# EasyEDA Pro project MicronetToNMEA.eprj

# Schematic MicronetToNMEA

## Sheets
1 MCU: Board Name: Main Board; Create Date: 2025-03-17; Page Name: MCU; Project Name: MicronetToNMEA; Schematic Name: MicronetToNMEA; Update Date: 2025-11-13; Drawn: 17/03/2025; Page Size: A4; Reviewed: No; Version: 3.0
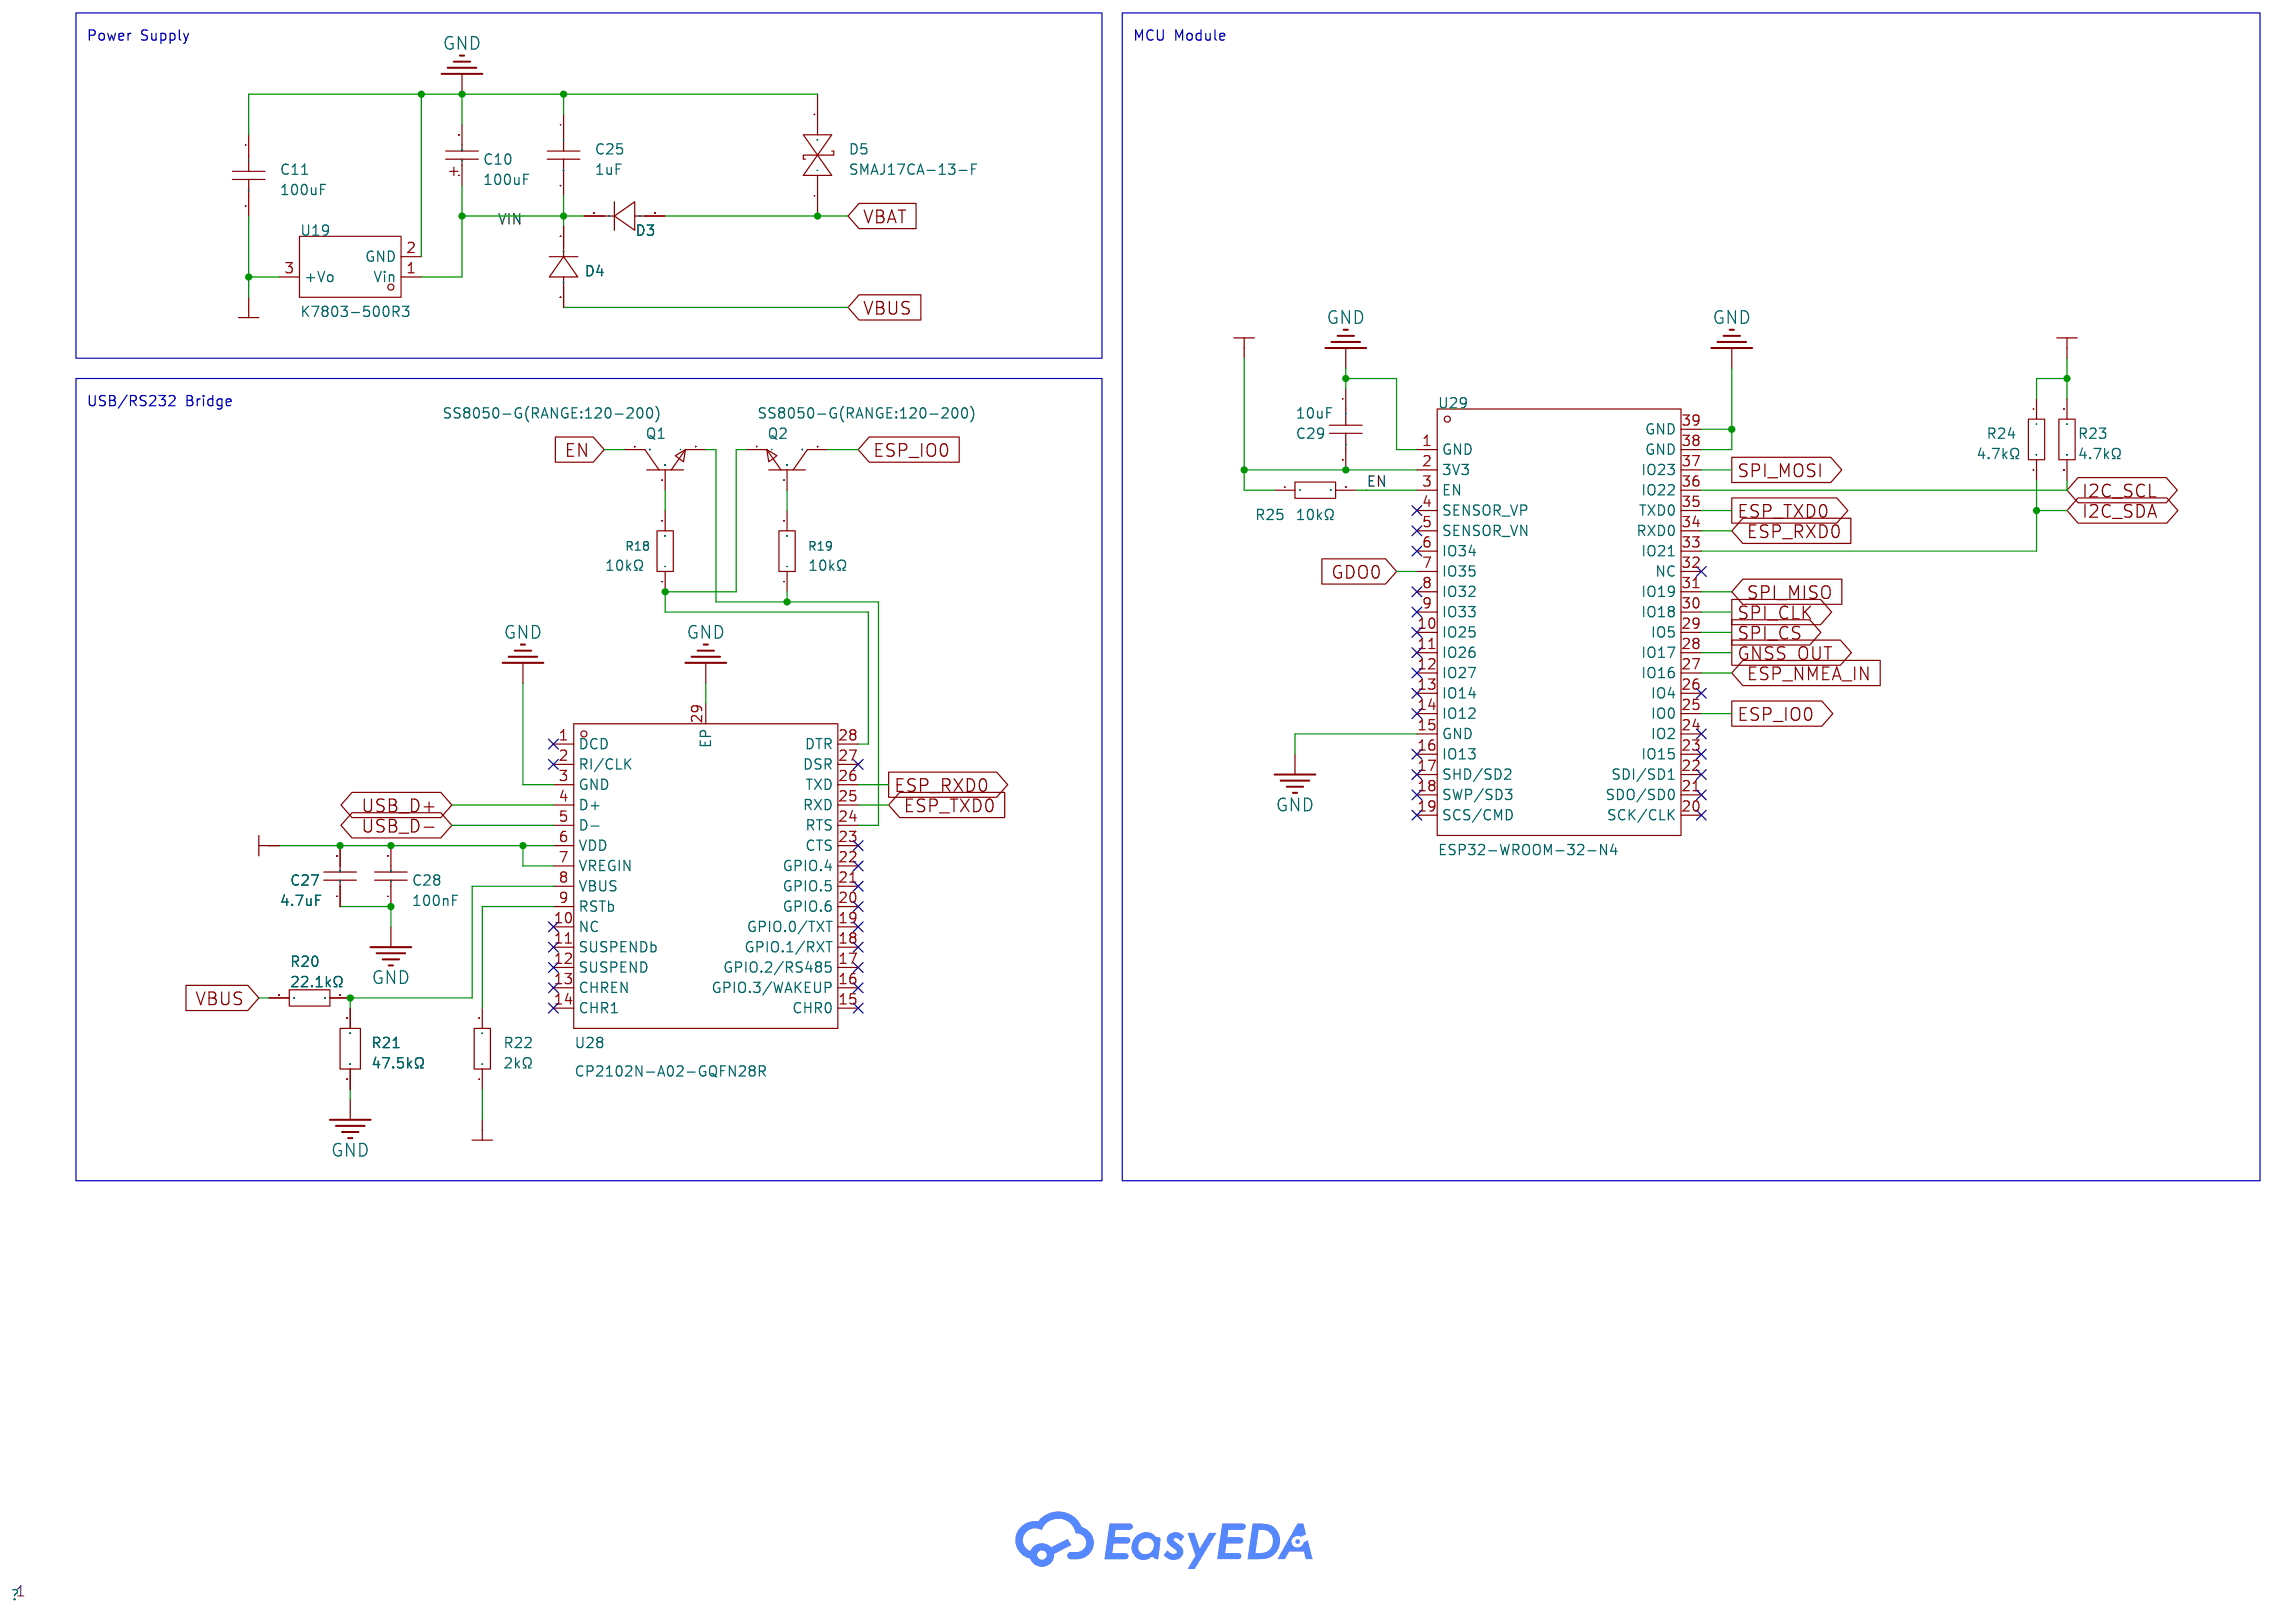
[diagram p0: MCU]
2 Peripherals: Page Name: Peripherals; Update Date: 2025-12-25
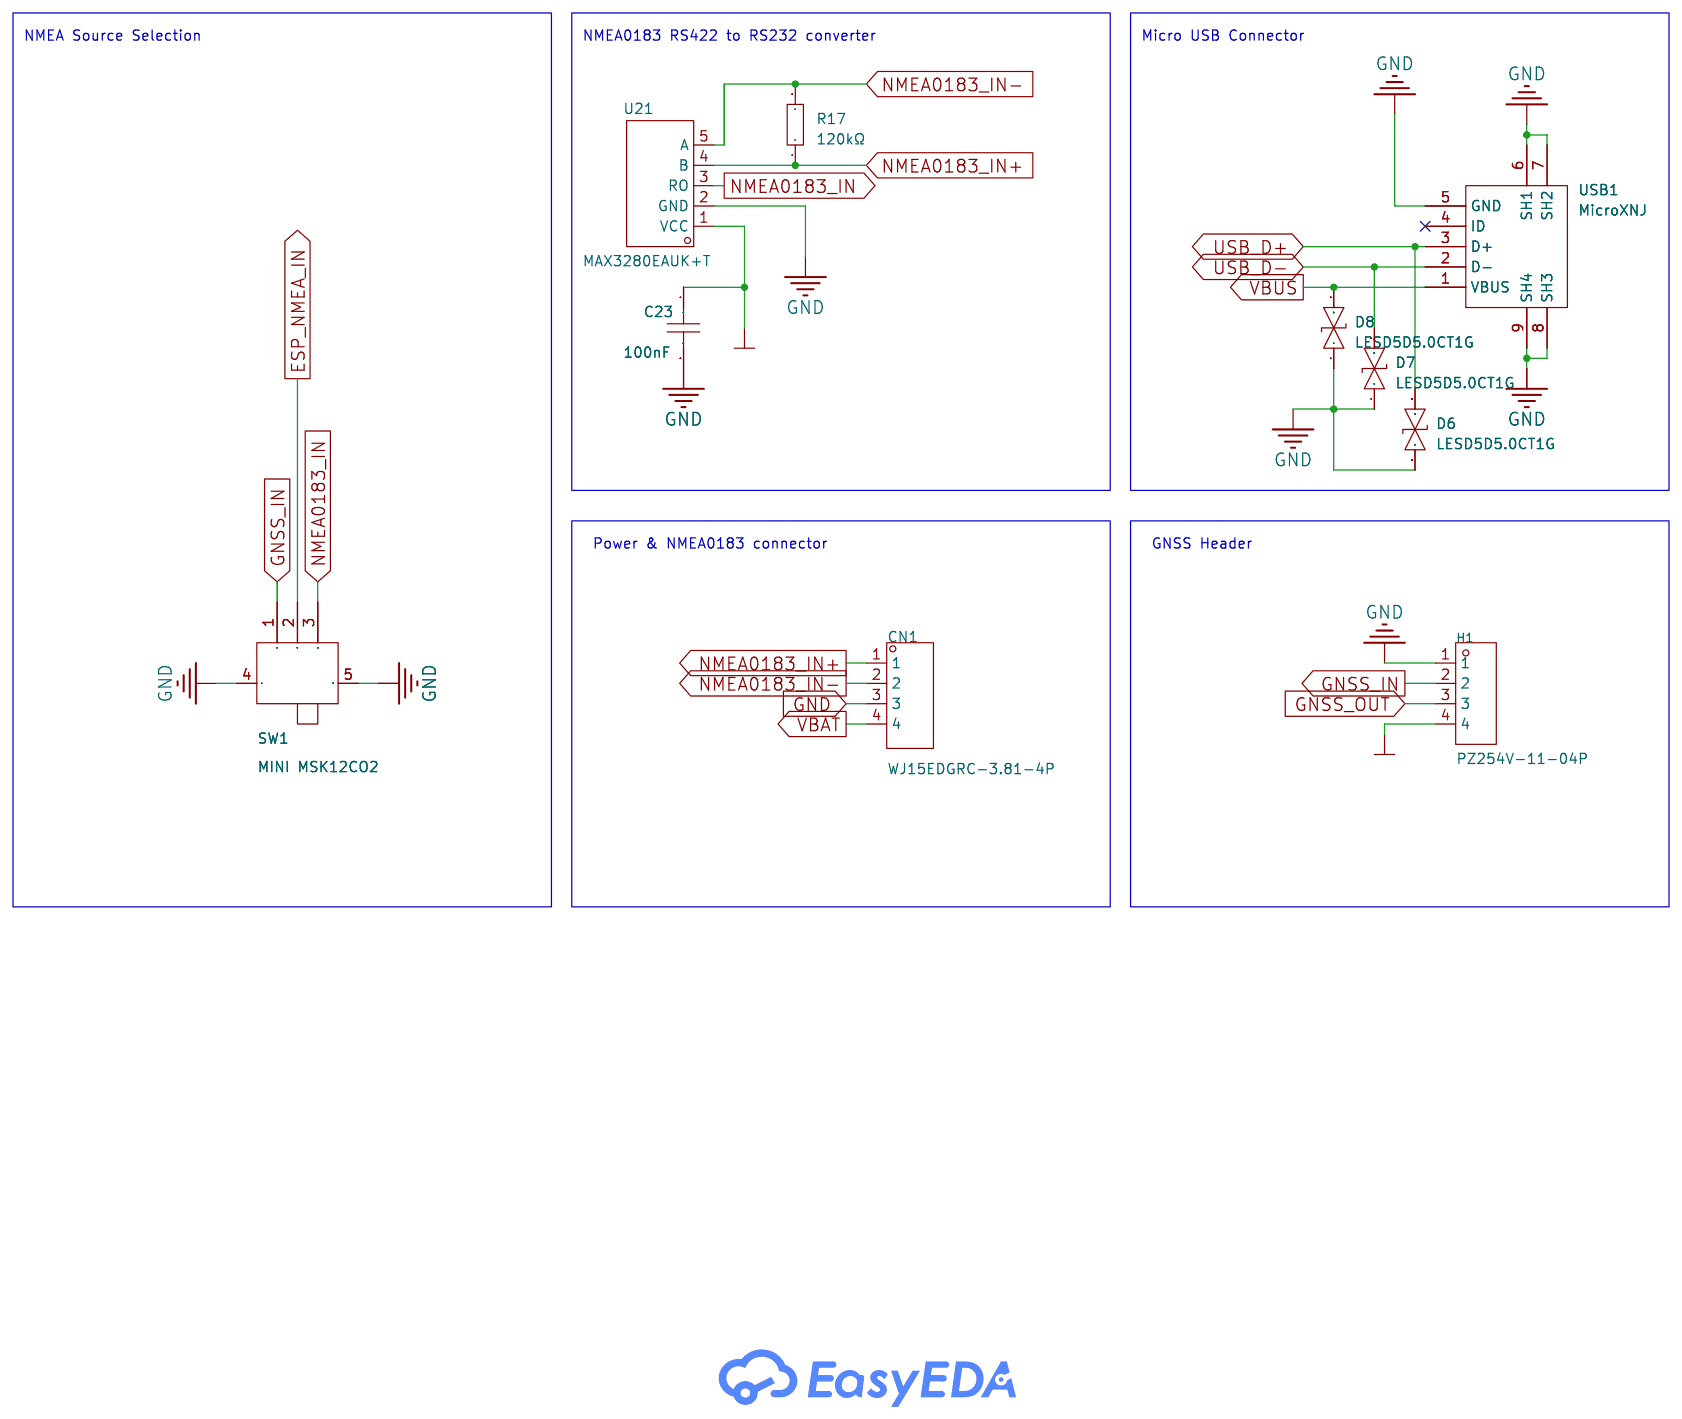
[diagram p1: Peripherals]
3 Micronet RF: Page Name: Micronet RF; Update Date: 2025-03-23
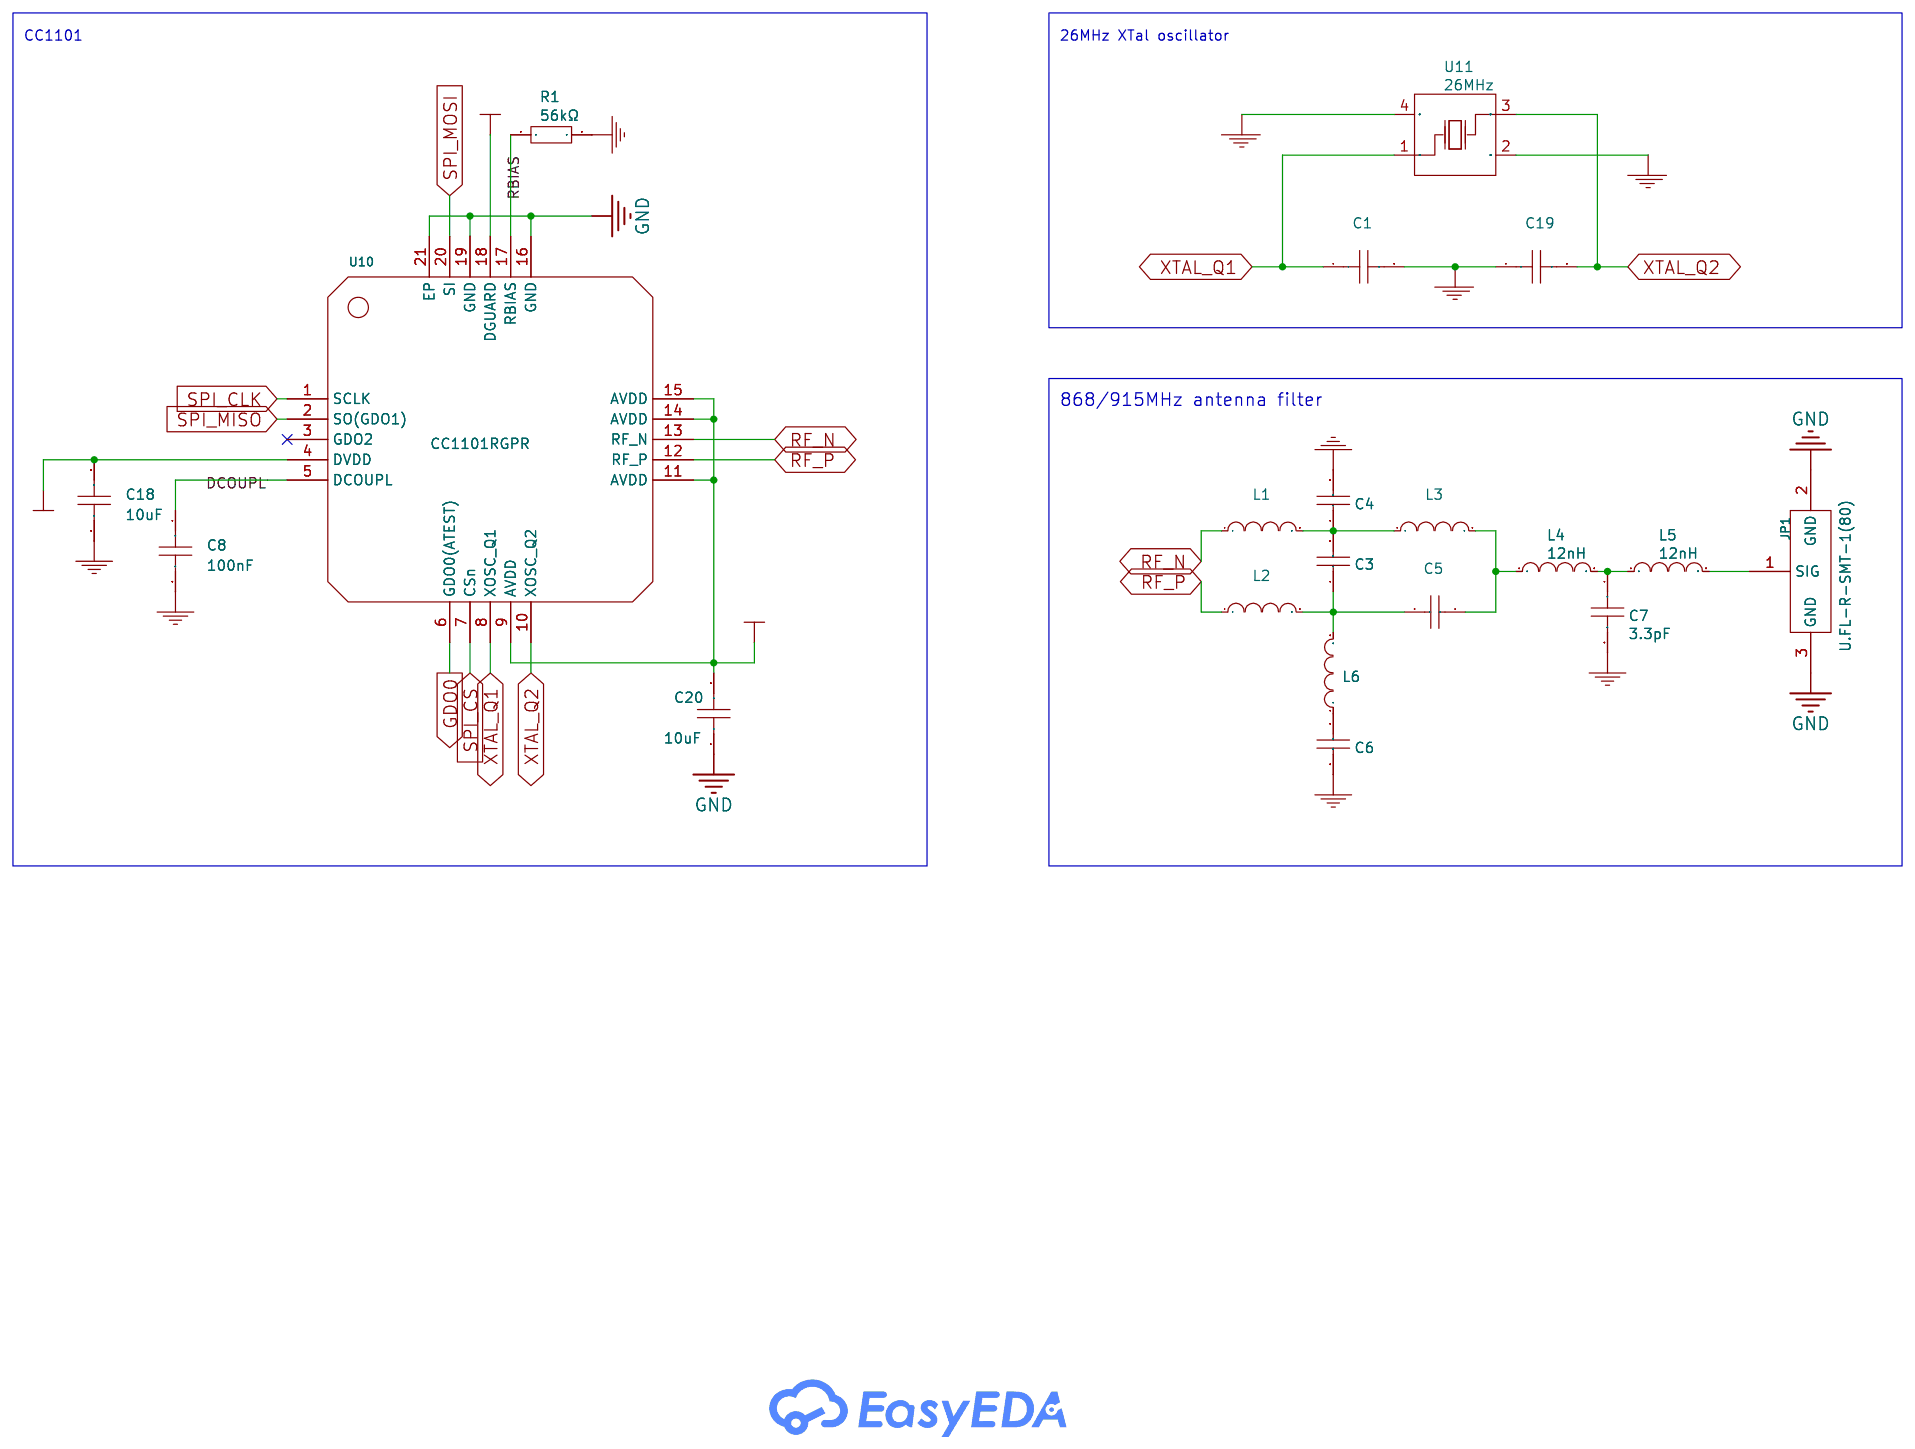
[diagram p2: Micronet RF]
4 Sensors: Page Name: Sensors; Update Date: 2025-03-29
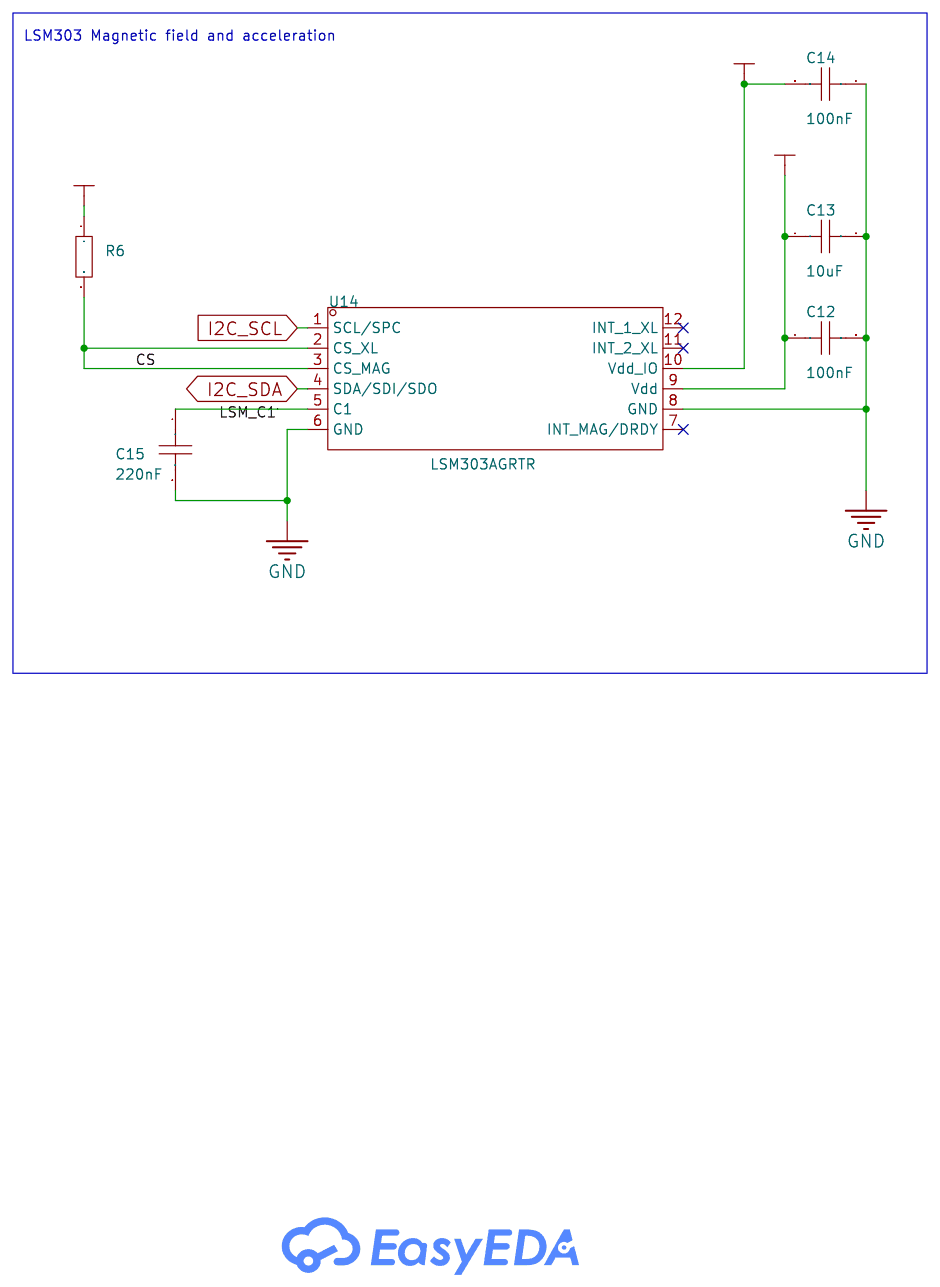
[diagram p3: Sensors]

## Parts
sheet MCU
C10  100uF  [CAP-SMD_BD8.0-L8.3-W8.3-FD]
C11  100uF  [C1210]
C25  1uF  [C0402]
C27  4.7uF  [C0603]
C28  100nF  [C0603]
C29  10uF  [C0603]
D3  1N4007WS  [SOD-323_L1.8-W1.3-LS2.5-RD]
D4  1N4007WS  [SOD-323_L1.8-W1.3-LS2.5-RD]
D5  SMAJ17CA-13-F  [SMA_L4.4-W2.6-LS5.0-BI]
Q1  SS8050-G(RANGE:120-200)  [SOT-23-3_L2.9-W1.3-P1.90-LS2.4-BR]
Q2  SS8050-G(RANGE:120-200)  [SOT-23-3_L2.9-W1.3-P1.90-LS2.4-BR]
R18  10kΩ  [R0603]
R19  10kΩ  [R0603]
R20  22.1kΩ  [R0603]
R21  47.5kΩ  [R0603]
R22  2kΩ  [R0603]
R23  4.7kΩ  [R0402]
R24  4.7kΩ  [R0402]
R25  10kΩ  [R0402]
U19  K7803-500R3  [PWRM-TH_K7803-500R3]
U28  CP2102N-A02-GQFN28R  [QFN-28_L5.0-W5.0-P0.50-TL-EP3.3]
U29  ESP32-WROOM-32-N4  [WIFIM-SMD_ESP32-WROOM-32-N4]
sheet Micronet RF
C1  27pF  [C0402]
C3  1pF  [C0402]
C4  1.5pF  [C0402]
C5  1.5pF  [C0402]
C6  100pF  [C0402]
C7  3.3pF  [C0402]
C8  100nF  [C0402]
C18  10uF  [C0402]
C19  27pF  [C0402]
C20  10uF  [C0402]
JP1  U.FL-R-SMT-1(80)  [RF-SMD_FRF05002-JSS103M]
L1  12nH  [L0402]
L2  12nH  [L0402]
L3  18nH  [L0402]
L4  12nH  [L0402]
L5  12nH  [L0402]
L6  18nH  [L0402]
R1  56kΩ  [R0402]
U10  CC1101RGPR  [QFN-20_L4.0-W4.0-P0.5-TL-EP]
U11  26MHz  [CRYSTAL-SMD_4P-L3.2-W2.5-BL]
sheet Peripherals
C23  100nF  [C0402]
CN1  WJ15EDGRC-3.81-4P  [CONN-TH_WJ15EDGRC-3.81-4P]
D6  LESD5D5.0CT1G  [SOD-523_L1.2-W0.8-LS1.6-BI]
D7  LESD5D5.0CT1G  [SOD-523_L1.2-W0.8-LS1.6-BI]
D8  LESD5D5.0CT1G  [SOD-523_L1.2-W0.8-LS1.6-BI]
H1  PZ254V-11-04P  [HDR-TH_4P-P2.54-V-M]
R17  120kΩ  [R0603]
SW1  MINI MSK12CO2  [SW-SMD_MSK12CO2]
U21  MAX3280EAUK+T  [SOT-23-5_L3.0-W1.7-P0.95-LS2.8-BL]
USB1  MicroXNJ  [MICRO-USB-SMD_MICROXNJ_1]
sheet Sensors
C12  100nF  [C0402]
C13  10uF  [C0402]
C14  100nF  [C0402]
C15  220nF  [C0402]
R6  10kΩ  [R0402]
U14  LSM303AGRTR  [LGA-12_L2.0-W2.0-P0.50-BL]

## Library data of the parts
C10 = EEEFK1H101P_C178548: Capacitance: Tolerance:±20% Tolerance:±20% Rated Voltage: Ripple Current:262.5mA@120Hz Equivalent Series Resistance(ESR):- φD: L: Lifetime @ Temp:5000hrs@105℃ Operating Temperature:-55℃~+105℃ Operating Temperature:-55℃~+105℃; LCSC Part Name: 100uF ±20% 50V; Supplier Part: C178548; Manufacturer: PANASONIC(松下); Manufacturer Part: EEEFK1H101P; Supplier Footprint: SMD,D8xL10.2mm; JLCPCB Part Class: Extended Part; Datasheet: https://atta.szlcsc.com/upload/public/pdf/source/20180327/C178734_B73BC829014A39870A1CD50DCE59BFEE.pdf; Supplier: LCSC; Tolerance: ±20%; Ripple Current: 262.5mA@120Hz; Lifetime @ Temp: 5000hrs@105℃; Operating Temperature: -55℃~+105℃
C11 = EMK325ABJ107MM-P: Capacitance: Tolerance:±20% Tolerance:±20% Voltage Rating: Temperature Coefficient:; LCSC Part Name: MSASE32MAB5107MPNA01 100uF ±20% 16V; Supplier Part: C90143; Manufacturer: TAIYO YUDEN(太诱); Supplier Footprint: 1210; JLCPCB Part Class: Extended Part; Datasheet: https://atta.szlcsc.com/upload/public/pdf/source/20240509/BF3467564CA221DD6EEF2C733FAD3586.pdf; Supplier: LCSC; Tolerance: ±20%
C25 = GRM155R61H105KE05D: Capacitance: Tolerance:±10% Tolerance:±10% Voltage Rated: Temperature Coefficient:; LCSC Part Name: 1uF ±10% 50V; Supplier Part: C1518208; Manufacturer: muRata(村田); Supplier Footprint: 0402; JLCPCB Part Class: Extended Part; Datasheet: https://atta.szlcsc.com/upload/public/pdf/source/20210607/3F03D47137F6EC7729AB4067EB2A6EB3.pdf; Supplier: LCSC; Tolerance: ±10%
C27 = CL10A475KQ8NNNC: LCSC Part Name: 4.7uF ±10% 6.3V; Supplier Part: C8032; Manufacturer: SAMSUNG(三星); Supplier Footprint: 0603; JLCPCB Part Class: Extended Part; Datasheet: https://item.szlcsc.com/datasheet/CL10A475KQ8NNNC/8510.html; Supplier: LCSC; Tolerance: ±10%; Voltage Rating: 6.3V; Temperature Coefficient: X5R
C28 = 0603B104K500NT_C30926: LCSC Part Name: 100nF ±10% 50V; Supplier Part: C30926; Manufacturer: FH(风华); Manufacturer Part: 0603B104K500NT; Supplier Footprint: 0603; JLCPCB Part Class: Extended Part; Datasheet: https://item.szlcsc.com/datasheet/0603B104K500NT/31683.html; Supplier: LCSC; Tolerance: ±10%; Voltage Rating: 50V; Temperature Coefficient: X7R
C29 = CL10A106MO8NQNC: Capacitance: Tolerance:±20% Tolerance:±20% Voltage Rated: Temperature Coefficient:; LCSC Part Name: 10uF ±20% 16V; Supplier Part: C92487; Manufacturer: SAMSUNG(三星); Supplier Footprint: 0603; JLCPCB Part Class: Extended Part; Datasheet: https://atta.szlcsc.com/upload/public/pdf/source/20221212/2AEE4C8656EA91AC055807CAAFF57F96.pdf; Supplier: LCSC; Tolerance: ±20%
D3 D4 = 1N4007WS_C193404: Diode Configuration: Forward Voltage (Vf@If):1.1V@1A Reverse Voltage (Vr): Rectified Current: Reverse Leakage Current:5uA@1kV; LCSC Part Name: 电压:1kV 电流:1A; Supplier Part: C193404; Manufacturer: MDD(辰达半导体); Supplier Footprint: SOD-323; JLCPCB Part Class: Extended Part; Datasheet: https://atta.szlcsc.com/upload/public/pdf/source/20230823/865291948DF6557226235927F2F58F05.pdf; Supplier: LCSC; Forward Voltage (Vf@If): 1.1V@1A; Reverse Leakage Current: 5uA@1kV
D5 = SMAJ17CA-13-F: LCSC Part Name: 双向TVS 17V截止; Supplier Part: C134964; Manufacturer: DIODES(美台); Supplier Footprint: SMA(DO-214AC); JLCPCB Part Class: Extended Part; Datasheet: https://atta.szlcsc.com/upload/public/pdf/source/20180308/C135025_15204897016241413928.pdf; Supplier: LCSC; Reverse Stand-Off Voltage (Vrwm): 17V; Maximum Clamping Voltage: 27.6V; Peak Pulse Current (Ipp): 14.5A; Peak Pulse Power Dissipation (Ppp): 400W; Breakdown Voltage: 18.9V; Type: TVS
Q1 Q2 = SS8050-G(RANGE:120-200): LCSC Part Name: L档(120-200) NPN 电流:1.5A 电压:25V; Supplier Part: C164886; Manufacturer: CJ(江苏长电/长晶); Supplier Footprint: SOT-23; JLCPCB Part Class: Extended Part; Datasheet: https://item.szlcsc.com/datasheet/SS8050-G(RANGE%253A120-200)/176268.html; Supplier: LCSC; type: NPN; Current - Collector(Ic): 1.5A; Collector - Emitter Voltage VCEO: 25V; Pd - Power Dissipation: 300mW; DC Current Gain: 120@100mA,1V; Transition frequency(fT): 100MHz; Current - Collector Cutoff: 100nA; Vce Saturation(VCE(sat)): 500mV@800mA,80mA; Operating Temperature: -55℃~+150℃; Emitter-Base Voltage(Vebo): 5V; Number: 1 NPN
R18 R19 = RMC060310K5%N: LCSC Part Name: 10kΩ ±5% 100mW; Supplier Part: C269684; Manufacturer: Tyohm(幸亚电阻); Supplier Footprint: 0603; JLCPCB Part Class: Extended Part; Datasheet: https://item.szlcsc.com/datasheet/RMC060310K5%2525N/259124.html; Supplier: LCSC; Type: Thick Film Resistor; Tolerance: ±5%; Power(Watts): 100mW; Voltage-Supply(Max): 50V; Temperature Coefficient: ±100ppm/℃; Operating Temperature: -55℃~+155℃
R20 = RC0603FR-0722K1L: LCSC Part Name: 厚膜电阻 22.1kΩ ±1% 100mW; Supplier Part: C137768; Manufacturer: YAGEO(国巨); Supplier Footprint: 0603; JLCPCB Part Class: Extended Part; Datasheet: https://item.szlcsc.com/datasheet/RC0603FR-0722K1L/149084.html; Supplier: LCSC; Type: Thick Film Resistor; Tolerance: ±1%; Power(Watts): 100mW; Voltage-Supply(Max): 75V; Temperature Coefficient: ±100ppm/℃; Operating Temperature: -55℃~+155℃
R21 = RT0603FRE0747K5L: LCSC Part Name: 薄膜电阻 47.5kΩ ±1% 100mW; Supplier Part: C706176; Manufacturer: YAGEO(国巨); Supplier Footprint: 0603; JLCPCB Part Class: Extended Part; Datasheet: https://atta.szlcsc.com/upload/public/pdf/source/20200720/C706176_7967DF4A4839E72D814B188785540CDD.pdf; Supplier: LCSC; Type: Thin Film Resistor; Tolerance: ±1%; Temperature Coefficient: ±50ppm/℃; Operating Temperature Range: -55℃~+155℃
R22 = RTT03202JTP: LCSC Part Name: 厚膜电阻 2kΩ ±5% 100mW; Supplier Part: C103396; Manufacturer: RALEC(旺诠); Supplier Footprint: 0603; JLCPCB Part Class: Extended Part; Datasheet: https://item.szlcsc.com/datasheet/RTT03202JTP/104611.html; Supplier: LCSC; Type: Thick Film Resistor; Tolerance: ±5%; Power(Watts): 100mW; Voltage-Supply(Max): 75V; Temperature Coefficient: ±100ppm/℃; Operating Temperature: -55℃~+155℃
R23 R24 = 0402WGJ0472TCE: Type:Thick Film Resistors Resistance:4.7kΩ Tolerance:±5% Tolerance:±5% Power(Watts): Overload Voltage (Max): Temperature Coefficient:±100ppm/℃ Temperature Coefficient:±100ppm/℃ Operating Temperature Range:-55℃~+155℃ Operating Temperature Range:-55℃~+155℃; LCSC Part Name: 4.7kΩ ±5% 62.5mW 厚膜电阻; Supplier Part: C25940; Manufacturer: UNI-ROYAL(厚声); Supplier Footprint: 0402; JLCPCB Part Class: Extended Part; Datasheet: https://atta.szlcsc.com/upload/public/pdf/source/20200306/C422600_1E6D84923E4A46A82E41ADD87F860B5C.pdf; Supplier: LCSC; Type: Thick Film Resistors; Tolerance: ±5%; Temperature Coefficient: ±100ppm/℃; Operating Temperature Range: -55℃~+155℃
R6 R25 = 0402WGJ0103TCE: Type:Thick Film Resistors Resistance:10kΩ Tolerance:±5% Tolerance:±5% Power(Watts): Overload Voltage (Max): Temperature Coefficient:±100ppm/℃ Temperature Coefficient:±100ppm/℃ Operating Temperature Range:-55℃~+155℃ Operating Temperature Range:-55℃~+155℃; LCSC Part Name: 10kΩ ±5% 62.5mW 厚膜电阻; Supplier Part: C25531; Manufacturer: UNI-ROYAL(厚声); Supplier Footprint: 0402; JLCPCB Part Class: Extended Part; Datasheet: https://atta.szlcsc.com/upload/public/pdf/source/20200306/C422600_1E6D84923E4A46A82E41ADD87F860B5C.pdf; Supplier: LCSC; Type: Thick Film Resistors; Tolerance: ±5%; Temperature Coefficient: ±100ppm/℃; Operating Temperature Range: -55℃~+155℃
U19 = K7803-500R3_C5369643: Supplier Part: C5369643; Manufacturer: YLPTEC(易川); Supplier Footprint: SIP,11.5x7.6mm; JLCPCB Part Class: Extended Part; Datasheet: https://atta.szlcsc.com/upload/public/pdf/source/20231130/A27A2C6619C01D10262DE302026A4639.pdf; Supplier: LCSC; Conversion Type: DC-DC; Function: Step-down type; Input Voltage(DC): 4.75V~36V; Output Voltage: 3.3V; Output Power: 1.65W; Output Current (Max): 500mA; Output Channel: 1; Conversion Efficiency: 96%; Feature: Short-Circuit  Protection; Maximum Capacitive Load: 680uF
U28 = CP2102N-A02-GQFN28R: Supplier Part: C964632; Manufacturer: SKYWORKS/SILICON LABS(芯科); Supplier Footprint: QFN-28-EP(5x5); JLCPCB Part Class: Extended Part; Datasheet: https://item.szlcsc.com/datasheet/CP2102N-A02-GQFN28R/1049893.html; Supplier: LCSC; Applications Function: USB to UART; USB Protocol: USB 2.0; Voltage - Supply: 3V~3.6V; Operating Temperature: -40℃~+85℃@(Ta); Current - Supply: 9.5mA; Supply Current (Iq): 1.3uA
U29 = ESP32-WROOM-32-N4: LCSC Part Name: WiFi+蓝牙4.2+双核CPU模块; Supplier Part: C82899; Manufacturer: ESPRESSIF(乐鑫); Supplier Footprint: SMD,18x25.5mm; JLCPCB Part Class: Extended Part; Datasheet: https://atta.szlcsc.com/upload/public/pdf/source/20241030/CCB539BBE3BF966BF47741EF6F78A315.pdf; Supplier: LCSC
C1 C19 = GJM1555C1H270FB01D: Capacitance: Tolerance:±1% Tolerance:±1% Voltage Rated: Temperature Coefficient:; LCSC Part Name: 27pF ±1% 50V; Supplier Part: C88883; Manufacturer: muRata(村田); Supplier Footprint: 0402; JLCPCB Part Class: Extended Part; Datasheet: https://atta.szlcsc.com/upload/public/pdf/source/20190904/C426118_85E81C7C1F21FC87C5FB6D536E0847B4.pdf; Supplier: LCSC; Tolerance: ±1%; Check: true
C3 = GRM1555C1H1R0CA01D: Capacitance: Voltage Rated: Temperature Coefficient:; LCSC Part Name: 1pF 50V; Supplier Part: C76953; Manufacturer: muRata(村田); Supplier Footprint: 0402; JLCPCB Part Class: Extended Part; Datasheet: https://atta.szlcsc.com/upload/public/pdf/source/20180307/C76953_15204091218821407741.pdf; Supplier: LCSC; Check: true
C4 C5 = GRM1555C1H1R5BA01D: Capacitance: Voltage Rated: Temperature Coefficient:; LCSC Part Name: 1.5pF 50V; Supplier Part: C76957; Manufacturer: muRata(村田); Supplier Footprint: 0402; JLCPCB Part Class: Extended Part; Datasheet: https://atta.szlcsc.com/upload/public/pdf/source/20180307/C76957_15204091256371407745.pdf; Supplier: LCSC; Check: true
C6 = GRM1555C1H101JA01D: Capacitance: Tolerance:±5% Tolerance:±5% Voltage Rated: Temperature Coefficient:; LCSC Part Name: 100pF ±5% 50V; Supplier Part: C77177; Manufacturer: muRata(村田); Supplier Footprint: 0402; JLCPCB Part Class: Extended Part; Datasheet: https://atta.szlcsc.com/upload/public/pdf/source/20161108/1478586482814.pdf; Supplier: LCSC; Tolerance: ±5%; Check: true
C7 = GRM1555C1H3R3CA01D: Capacitance: Voltage Rated: Temperature Coefficient:; LCSC Part Name: 3.3pF 50V; Supplier Part: C76968; Manufacturer: muRata(村田); Supplier Footprint: 0402; JLCPCB Part Class: Extended Part; Datasheet: https://atta.szlcsc.com/upload/public/pdf/source/20180326/C76968_42A943F46D0EB2822F2395CFA6966D50.pdf; Supplier: LCSC; Check: true
C8 = GRM155R62A104KE14D: Capacitance: Tolerance:±10% Tolerance:±10% Voltage Rated: Temperature Coefficient:; LCSC Part Name: 100nF ±10% 100V; Supplier Part: C162178; Manufacturer: muRata(村田); Supplier Footprint: 0402; JLCPCB Part Class: Extended Part; Datasheet: https://atta.szlcsc.com/upload/public/pdf/source/20200921/C162178_EF61A2DC43497DE67E2F462D3389BE9B.pdf; Supplier: LCSC; Tolerance: ±10%; Check: true
C18 C20 = GRM155R61A106ME44D: Capacitance: Tolerance:±20% Tolerance:±20% Voltage Rated: Temperature Coefficient:; LCSC Part Name: 10uF ±20% 10V; Supplier Part: C77000; Manufacturer: muRata(村田); Supplier Footprint: 0402; JLCPCB Part Class: Extended Part; Datasheet: https://atta.szlcsc.com/upload/public/pdf/source/20180530/C77000_4866797CFE3A842CD03C597EBD6AE6CD.pdf; Supplier: LCSC; Tolerance: ±20%
JP1 = U.FL-R-SMT-1(80)_C88374: Connector Type:板端 Interface Type:内针 Number of Ports:1 Interface Diameter:2mm Interface Length/Height:1.25mm Frequency-Max:6GHz RF Series:IPEX Impedance:50Ω Style:- Contact Material:Brass Operating Temperature Range:-40℃~+90℃ Operating Temperature Range:-4; LCSC Part Name: IPEX 内针; Supplier Part: C88374; Manufacturer: HRS(广濑); Supplier Footprint: SMD; JLCPCB Part Class: Extended Part; Datasheet: https://atta.szlcsc.com/upload/public/pdf/source/20161125/1480067868647.pdf; Supplier: LCSC; Connector Type: 板端; Interface Type: 内针; Number of Ports: 1; Interface Diameter: 2mm; Interface Length/Height: 1.25mm; Frequency-Max: 6GHz; RF Series: IPEX; Impedance: 50Ω; Contact Material: Brass; Operating Temperature Range: -40℃~+90℃; Check: true
L1 L2 = LQW15AN12NJ00D: Inductance: Tolerance:±5% Tolerance:±5% Rated Current: Saturation Current (Isat):- DC Resistance (DCR): Ratings:-; LCSC Part Name: 12nH ±5%; Supplier Part: C82920; Manufacturer: muRata(村田); Supplier Footprint: 0402; JLCPCB Part Class: Extended Part; Datasheet: https://atta.szlcsc.com/upload/public/pdf/source/20170505/1493951387766.pdf; Supplier: LCSC; Tolerance: ±5%; Check: true
L3 L6 = LQW15AN18NJ00D: Inductance: Tolerance:±5% Tolerance:±5% Rated Current: Saturation Current (Isat):- DC Resistance (DCR): Ratings:-; LCSC Part Name: 18nH ±5%; Supplier Part: C82917; Manufacturer: muRata(村田); Supplier Footprint: 0402; JLCPCB Part Class: Extended Part; Datasheet: https://atta.szlcsc.com/upload/public/pdf/source/20170325/1490427880337.pdf; Supplier: LCSC; Tolerance: ±5%; Check: true
L4 L5 = LQW15AN12NG00D: Inductance: Tolerance:±2% Tolerance:±2% Rated Current: Saturation Current (Isat):- DC Resistance (DCR): Ratings:-; LCSC Part Name: 12nH ±2%; Supplier Part: C86128; Manufacturer: muRata(村田); Supplier Footprint: 0402; JLCPCB Part Class: Extended Part; Datasheet: https://atta.szlcsc.com/upload/public/pdf/source/20161104/1478253457680.pdf; Supplier: LCSC; Tolerance: ±2%; Check: true
R1 = RK73H1ETTP5602F: Type:Thick Film Resistors Resistance: Tolerance:±1% Tolerance:±1% Power(Watts): Overload Voltage (Max): Temperature Coefficient:±100ppm/℃ Temperature Coefficient:±100ppm/℃ Operating Temperature Range:-55℃~+155℃ Operating Temperature Range:-55℃~+155℃; LCSC Part Name: 厚膜电阻 56kΩ ±1% 100mW; Supplier Part: C71703; Manufacturer: KOA; Supplier Footprint: 0402; JLCPCB Part Class: Extended Part; Datasheet: https://atta.szlcsc.com/upload/public/pdf/source/20180126/C171778_15169517982501308609.pdf; Supplier: LCSC; Type: Thick Film Resistors; Tolerance: ±1%; Temperature Coefficient: ±100ppm/℃; Operating Temperature Range: -55℃~+155℃; Check: true
U10 = CC1101RGPR: Frequency Range:779MHz~928MHz；300MHz~348MHz Frequency Range:779MHz~928MHz；300MHz~348MHz Interface:SPI Operating Voltage:1.8V~3.6V Operating Voltage:1.8V~3.6V Applications:General-purposeISM Output Power:12dBm Data Rate:600Kbps Current Of Transmitting:12.3; LCSC Part Name: 低功率射频收发器 专为极低功耗无线应用设计; Supplier Part: C29953; Manufacturer: TI(德州仪器); Supplier Footprint: QFN-20-EP(4x4); JLCPCB Part Class: Extended Part; Datasheet: https://www.ti.com/cn/lit/gpn/cc1101; Supplier: LCSC; Frequency Range: 779MHz~928MHz；300MHz~348MHz; Interface: SPI; Operating Voltage: 1.8V~3.6V; Applications: General-purposeISM; Output Power: 12dBm; Data Rate: 600Kbps; Current Of Transmitting: 12.3mA; Sensitivity: -116dBm; Receive Current: 14.3mA; Typical Application Frequency: 433MHz；315MHz; Operating Temperature: -40℃~+85℃; Check: true
U11 = S3226000151040: Crystal Type:贴片晶振 Frequency: Normal temperature Frequency Tolerance:±10ppm Normal temperature Frequency Tolerance:±10ppm External load capacitor: Equivalent Series Resistance (ESR):40Ω Operating Temperature: Operating Temperature:; LCSC Part Name: 26MHz ±10ppm 15pF; Supplier Part: C479205; Manufacturer: JGHC(晶光华); Supplier Footprint: SMD3225-4P; JLCPCB Part Class: Extended Part; Datasheet: https://atta.szlcsc.com/upload/public/pdf/source/20230522/40D5BBD3CE23FDD9A2980F79514F1325.pdf; Supplier: LCSC; Crystal Type: 贴片晶振; Normal temperature Frequency Tolerance: ±10ppm; Equivalent Series Resistance (ESR): 40Ω; Check: true
C12 C14 C23 = CL05B104KO5NNNC: Capacitance: Tolerance:±10% Tolerance:±10% Voltage Rated: Temperature Coefficient:; LCSC Part Name: 100nF ±10% 16V; Supplier Part: C1525; Manufacturer: SAMSUNG(三星); Supplier Footprint: 0402; JLCPCB Part Class: Basic Part; Datasheet: https://atta.szlcsc.com/upload/public/pdf/source/20160218/1457707763339.pdf; Supplier: LCSC; Tolerance: ±10%
CN1 = WJ15EDGRC-3.81-4P: Connector Type:Receptacle-Close fixed form:- Structure:1x4P Pitch:3.81mm Color:- Mounting Style:Bend Number of Pins:4P Number of Rows:1 Number of PINs Per Row:4 Current Rating (Max):8A Voltage Rating (Max):300V Wire Gauge - AWG:- Wire Gauge - AWG:- Wire G; LCSC Part Name: 1x4P 3.81mm 排数:1 每排P数:4; Supplier Part: C7245; Manufacturer: KANGNEX(康奈克斯电气); Supplier Footprint: 弯插,P=3.81mm; JLCPCB Part Class: Extended Part; Datasheet: https://atta.szlcsc.com/upload/public/pdf/source/20191225/C7245_837ECEBE031BAC19A7EBD4F3127022E5.pdf; Supplier: LCSC; Connector Type: Receptacle-Close; Structure: 1x4P; Pitch: 3.81mm; Mounting Style: Bend; Number of Pins: 4P; Number of Rows: 1; Number of PINs Per Row: 4; Current Rating (Max): 8A; Voltage Rating (Max): 300V; Contact Material: Brass; Contact Plating: Tin; Operating Temperature Range: -40℃~+105℃
D6-D8 = LESD5D5.0CT1G_C41399463: LCSC Part Name: 双向ESD 5V截止 峰值脉冲电流：7A; Supplier Part: C41399463; Manufacturer: GOODWORK(固得沃克); Supplier Footprint: SOD-523; JLCPCB Part Class: Extended Part; Datasheet: https://item.szlcsc.com/datasheet/LESD5D5.0CT1G/43196790.html; Supplier: LCSC; Polarity: Bidirectional; Reverse Stand-Off Voltage (Vrwm): 5V; Clamping Voltage: 16V; Peak Pulse Current (Ipp): 7A; Peak Pulse Power Dissipation (Ppp): 100W; Voltage - Breakdown: 7V; Reverse Leakage Current (Ir): 1uA; Operating Temperature: -55℃~+150℃@(Tj); level of protection: IEC 61000-4-2; Type: ESD; Junction Capacitance: 12pF
H1 = PZ254V-11-04P: LCSC Part Name: 1x4P 间距:2.54mm 方针 直插; Supplier Part: C2691448; Manufacturer: XFCN(兴飞); Supplier Footprint: 插件,P=2.54mm; JLCPCB Part Class: Extended Part; Datasheet: https://item.szlcsc.com/datasheet/PZ254V-11-04P/2801085.html; Supplier: LCSC; Pin Structure: 1x4P; Pitch: 2.54mm; Circluar Pins/Square Pins: Pin Header; Mounting Type: Through Hole; Number of Rows: 1; Number of Pins: 4P; Current Rating: 3A; Voltage Rating (Max): 250V; Length of Mating Pin: 6mm; Insulation Height: 2.5mm; Length of End Connection Pin: 3mm; Operating Temperature: -40℃~+105℃; Color: Black
R17 = 0603WAF1203T5E: Type:Thick Film Resistor Resistance:120kΩ Tolerance:±1% Tolerance:±1% Power(Watts):100mW Voltage-Supply(Max):75V Temperature Coefficient:±100ppm/℃ Temperature Coefficient:±100ppm/℃ Operating Temperature:-55℃~+155℃ Operating Temperature:-55℃~+155℃; LCSC Part Name: 120kΩ ±1% 100mW 厚膜电阻; Supplier Part: C25808; Manufacturer: UNI-ROYAL(厚声); Supplier Footprint: 0603; JLCPCB Part Class: Basic Part; Datasheet: https://item.szlcsc.com/datasheet/0603WAF1203T5E/26551.html; Supplier: LCSC; Type: Thick Film Resistor; Tolerance: ±1%; Power(Watts): 100mW; Voltage-Supply(Max): 75V; Temperature Coefficient: ±100ppm/℃; Operating Temperature: -55℃~+155℃
SW1 = MINI MSK12CO2: LCSC Part Name: 迷你七脚两档侧拨拨动 mini七7脚 微型拨动; Supplier Part: C2681570; Manufacturer: SHOU HAN(首韩); Supplier Footprint: SMD,5x2.8mm; JLCPCB Part Class: Extended Part; Datasheet: https://item.szlcsc.com/datasheet/MINI%2520MSK12CO2/2774913.html; Supplier: LCSC; Circuit: SPDT; Actuator Style: Rectangular Columnar; Termination Style: SMD(SMT) Tab; Length: 5mm; Width: 2.75mm; Switch Height: 1.4mm; Mounting Type: Surface Mount, Right Angle; Actuator Color: White; Current Rating: 50mA; Voltage Rating: 12V; Life: 10,000 Cycles; Operating Temperature: -25℃~+70℃
U21 = MAX3280EAUK+T: Types:Receivers Number of Driver:0 Number of receiver:1 Supply Voltage:3V~5.5V Supply Voltage:3V~5.5V Data Rate:52Mbps Data Rate:52Mbps Operating Temperature:-40℃~+125℃ Operating Temperature:-40℃~+125℃; LCSC Part Name: ±15kV ESD保护，52Mbps，3V至5.5V，SOT23封装RS-485/RS-422真故障安全接收器; Supplier Part: C131126; Manufacturer: ADI(亚德诺)/MAXIM(美信); Supplier Footprint: SOT-23-5; JLCPCB Part Class: Extended Part; Datasheet: https://atta.szlcsc.com/upload/public/pdf/source/20170919/C131126_1505787254709976995.pdf; Supplier: LCSC; Types: Receivers; Number of Driver: 0; Number of receiver: 1; Supply Voltage: 3V~5.5V; Data Rate: 52Mbps; Operating Temperature: -40℃~+125℃; Check: true
USB1 = MicroXNJ: LCSC Part Name: Micro-B 母 卧贴; Supplier Part: C404969; Manufacturer: SHOU HAN(首韩); Supplier Footprint: SMD; JLCPCB Part Class: Extended Part; Datasheet: https://item.szlcsc.com/datasheet/MicroXNJ/392534.html; Supplier: LCSC; Connector Type: Micro-B; Protocol Standard: USB 2.0; Gender: Female; Mounting Type: Surface Mount, Right Angle; Number of Contacts: 5P; Number of Ports: 1; Current Rating-Power: 1.8A; Voltage Rating: 30V; Connect-Disconnect Life: 5,000 times; Detection color: Black; Operating Temperature: -20℃~+85℃
C13 = GRM155R60J106ME44D: Capacitance: Tolerance:±20% Tolerance:±20% Voltage Rated: Temperature Coefficient:; LCSC Part Name: 10uF ±20% 6.3V; Supplier Part: C76991; Manufacturer: muRata(村田); Supplier Footprint: 0402; JLCPCB Part Class: Extended Part; Datasheet: https://atta.szlcsc.com/upload/public/pdf/source/20200305/C490387_23319AE8C154DEB24C505E6C82A8106A.pdf; Supplier: LCSC; Tolerance: ±20%; Check: true
C15 = CL05B224KO5NNNC: Capacitance: Tolerance:±10% Tolerance:±10% Voltage Rated: Temperature Coefficient:; LCSC Part Name: 220nF ±10% 16V; Supplier Part: C16772; Manufacturer: SAMSUNG(三星); Supplier Footprint: 0402; JLCPCB Part Class: Basic Part; Datasheet: https://atta.szlcsc.com/upload/public/pdf/source/20160218/1457707763339.pdf; Supplier: LCSC; Tolerance: ±10%
U14 = LSM303AGRTR: Sensor Type:加速度传感器 Operating Temperature:-40℃~+85℃ Operating Temperature:-40℃~+85℃; Supplier Part: C126671; Manufacturer: ST(意法半导体); Supplier Footprint: LGA-12(2x2); JLCPCB Part Class: Extended Part; Datasheet: https://atta.szlcsc.com/upload/public/pdf/source/20180403/C126671_E4CABC5ABBEC58D74E548CEDEFA0489C.pdf; Supplier: LCSC; Sensor Type: 加速度传感器; Operating Temperature: -40℃~+85℃; Check: true

## Nets
+3.3V: C11.2 C12.1 C13.1 C14.2 C18.2 C20.2 C23.1 C27.2 C28.2 C29.2 H1.4 R6.1 R22.1 R23.1 R24.1 R25.1 U10.4(DVDD) U10.9(AVDD) U10.11(AVDD) U10.14(AVDD) U10.15(AVDD) U10.18(DGUARD) U14.9(Vdd) U14.10(Vdd_IO) U19.3(+Vo) U21.1(VCC) U28.6(VDD) U28.7(VREGIN) U29.2(3V3)
GND: C1.2 C4.2 C6.2 C7.2 C8.2 C10.2 C11.1 C12.2 C13.2 C14.1 C15.2 C18.1 C19.1 C20.1 C23.2 C25.1 C27.1 C28.1 C29.1 CN1.3 D5.2 D6.1 D7.1 D8.1 H1.1 JP1.2(GND) JP1.3(GND) R1.2 R21.1 SW1.4 SW1.5 U10.16(GND) U10.19(GND) U10.21(EP) U11.2(GND) U11.4(GND) U14.6(GND) U14.8(GND) U19.2(GND) U21.2(GND) U28.3(GND) U28.29(EP) U29.1(GND) U29.15(GND) U29.38(GND) U29.39(GND) USB1.5(GND) USB1.6(SH1) USB1.7(SH2) USB1.8(SH3) USB1.9(SH4)
VBAT: CN1.4 D3.2(A) D5.1
VBUS: D4.2(A) D8.2 R20.2 USB1.1(VBUS)
VIN: C10.1 C25.2 D3.1(K) D4.1(K) U19.1(Vin)
CS: R6.2 U14.2(CS_XL) U14.3(CS_MAG)
DCOUPL: C8.1 U10.5(DCOUPL)
EN: Q1.3(C) R25.2 U29.3(EN)
ESP_IO0: Q2.3(C) U29.25(IO0)
ESP_NMEA_IN: SW1.2 U29.27(IO16)
ESP_RXD0: U28.26(TXD) U29.34(RXD0)
ESP_TXD0: U28.25(RXD) U29.35(TXD0)
GDO0: U10.6(GDO0(ATEST)) U29.7(IO35)
GNSS_IN: H1.2 SW1.1
GNSS_OUT: H1.3 U29.28(IO17)
I2C_SCL: R23.2 U14.1(SCL/SPC) U29.36(IO22)
I2C_SDA: R24.2 U14.4(SDA/SDI/SDO) U29.33(IO21)
LSM_C1: C15.1 U14.5(C1)
NMEA0183_IN: SW1.3 U21.3(RO)
NMEA0183_IN+: CN1.1 R17.1 U21.4(B)
NMEA0183_IN-: CN1.2 R17.2 U21.5(A)
RBIAS: R1.1 U10.17(RBIAS)
RF_N: L1.1 U10.13(RF_N)
RF_P: L2.1 U10.12(RF_P)
SPI_CLK: U10.1(SCLK) U29.30(IO18)
SPI_CS: U10.7(CSn) U29.29(IO5)
SPI_MISO: U10.2(SO(GDO1)) U29.31(IO19)
SPI_MOSI: U10.20(SI) U29.37(IO23)
USB_D+: D6.2 U28.4(D+) USB1.3(D+)
USB_D-: D7.2 U28.5(D-) USB1.2(D-)
XTAL_Q1: C1.1 U10.8(XOSC_Q1) U11.1(OSC1)
XTAL_Q2: C19.2 U10.10(XOSC_Q2) U11.3(OSC2)
$1N23077: Q1.2(E) R19.1 U28.24(RTS)
$1N23080: Q1.1(B) R18.2
$1N23084: Q2.2(E) R18.1 U28.28(DTR)
$1N23089: Q2.1(B) R19.2
$1N23504: R20.1 R21.2 U28.8(VBUS)
$1N23624: R22.2 U28.9(RSTb)
$3N1118: C3.2 C4.1 L1.2 L3.1
$3N1119: C5.1 L3.2 L4.1
$3N1120: C7.1 L4.2 L5.1
$3N1121: JP1.1(SIG) L5.2
$3N1122: C6.1 L6.1
$3N1126: C3.1 C5.2 L2.2 L6.2

Not connected (* = marked no-connect by the designer): U10 3(GDO2)*; U14 7(INT_MAG/DRDY)* 11(INT_2_XL)* 12(INT_1_XL)*; U28 1(DCD)* 2(RI/CLK)* 10(NC)* 11(SUSPENDb)* 12(SUSPEND)* 13(CHREN)* 14(CHR1)* 15(CHR0)* 16(GPIO.3/WAKEUP)* 17(GPIO.2/RS485)* 18(GPIO.1/RXT)* 19(GPIO.0/TXT)* 20(GPIO.6)* 21(GPIO.5)* 22(GPIO.4)* 23(CTS)* 27(DSR)*; U29 4(SENSOR_VP)* 5(SENSOR_VN)* 6(IO34)* 8(IO32)* 9(IO33)* 10(IO25)* 11(IO26)* 12(IO27)* 13(IO14)* 14(IO12)* 16(IO13)* 17(SHD/SD2)* 18(SWP/SD3)* 19(SCS/CMD)* 20(SCK/CLK)* 21(SDO/SD0)* 22(SDI/SD1)* 23(IO15)* 24(IO2)* 26(IO4)* 32(NC)*; USB1 4(ID)*

## Notes on the sheets
sheet 1
- Power Supply
- MCU Module
- USB/RS232 Bridge
sheet 2
- NMEA Source Selection
- NMEA0183 RS422 to RS232 converter
- Micro USB Connector
- Power & NMEA0183 connector
- GNSS Header
sheet 3
- CC1101
- 26MHz XTal oscillator
- 868/915MHz antenna filter
sheet 4
- LSM303 Magnetic field and acceleration

# Board PCB
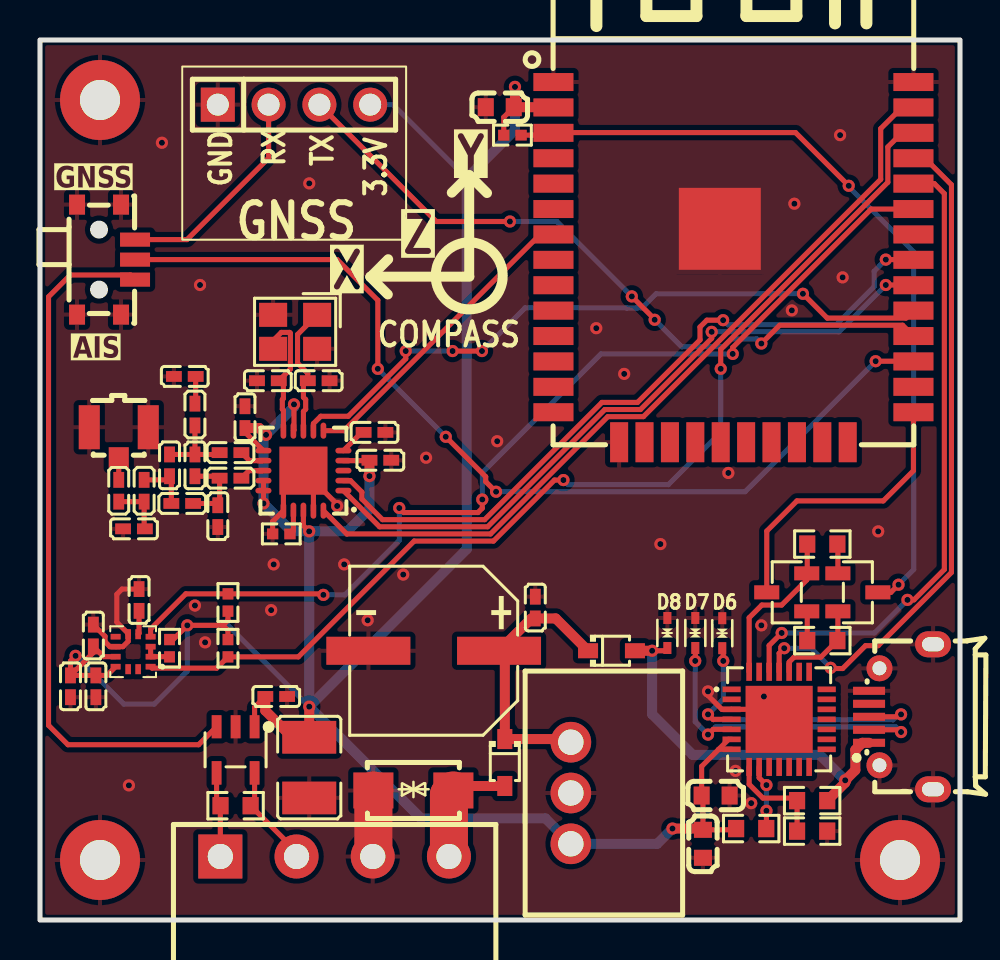
[diagram p4: board, top side]
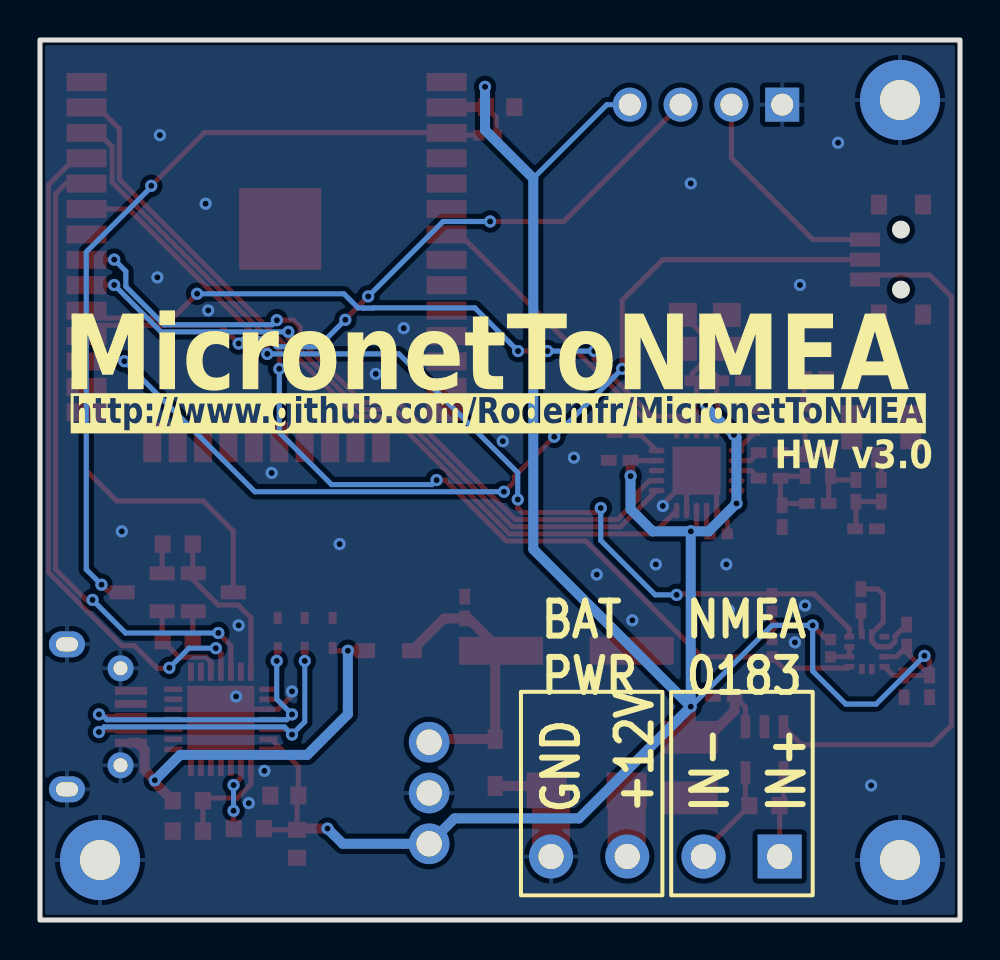
[diagram p5: board, bottom side, seen from below]

Outline 46 x 44 mm; copper layers: Top Layer, Bottom Layer. Coordinates in mm from the lower left corner of the outline.
Outline path: rectangle 0,44 46,0
Stack: Top Layer 0.035mm / Dielectric1 1.51mm FR4 er 4.5 / Bottom Layer 0.035mm

## Design rules (mm)
template: JLCPCB Capability(Two Layers Board)
spacing copperThickness1oz (default): track to track 0.102, other pairs 0.152 to 0.3
spacing copperThickness2oz: track to track 0.203, other pairs 0.152 to 0.3
track width copperThickness1oz (default): min 0.127, default 0.254, max 2.54
track width copperThickness2oz: min 0.203, default 0.254, max 2.54
differential pair differentialPair (default): width min 0.127, default 0.254, max 2.54; gap min 0.152, default 0.152
via viaSize (default): diameter min 0.5, default 0.61, max 10; hole min 0.3, default 0.305, max 6.3

## Placement (name value [footprint] x y rotation side)
C1  27pF  [C0402]  13.93 26.96 0 top
C3  1pF  [C0402]  7.75 22.73 270 top
C4  1.5pF  [C0402]  8.89 20.19 270 top
C5  1.5pF  [C0402]  6.48 22.73 90 top
C6  100pF  [C0402]  7.24 27.18 180 top
C7  3.3pF  [C0402]  4.7 19.56 180 top
C8  100nF  [C0402]  16.73 24.38 0 top
C10  100uF  [CAP-SMD_BD8.0-L8.3-W8.3-FD]  19.69 13.46 180 top
C11  100uF  [C1210]  13.46 7.62 90 top
C12  100nF  [C0402]  2.67 14.22 90 top
C13  10uF  [C0402]  1.52 11.68 270 top
C14  100nF  [C0402]  2.79 11.68 90 top
C15  220nF  [C0402]  4.95 16 90 top
C18  10uF  [C0402]  17.02 22.99 180 top
C19  27pF  [C0402]  11.39 26.96 0 top
C20  10uF  [C0402]  10.25 25.14 270 top
C23  100nF  [C0402]  11.81 11.18 0 top
C25  1uF  [C0402]  24.76 15.62 270 top
C27  4.7uF  [C0603]  33.15 3.81 90 top
C28  100nF  [C0603]  33.78 6.22 180 top
C29  10uF  [C0603]  22.99 40.64 0 top
CN1  WJ15EDGRC-3.81-4P  [CONN-TH_WJ15EDGRC-3.81-4P]  14.73 3.17 0 top
D3  1N4007WS  [SOD-323_L1.8-W1.3-LS2.5-RD]  23.24 7.87 270 top
D4  1N4007WS  [SOD-323_L1.8-W1.3-LS2.5-RD]  28.57 13.46 0 top
D5  SMAJ17CA-13-F  [SMA_L4.4-W2.6-LS5.0-BI]  18.67 6.48 180 top
D6  LESD5D5.0CT1G  [SOD-523_L1.2-W0.8-LS1.6-BI]  34.11 14.34 270 top
D7  LESD5D5.0CT1G  [SOD-523_L1.2-W0.8-LS1.6-BI]  32.77 14.35 270 top
D8  LESD5D5.0CT1G  [SOD-523_L1.2-W0.8-LS1.6-BI]  31.37 14.35 270 top
H1  PZ254V-11-04P  [HDR-TH_4P-P2.54-V-M]  12.7 40.77 0 top
JP1  U.FL-R-SMT-1(80)  [RF-SMD_FRF05002-JSS103M]  3.94 23.88 0 top
L1  12nH  [L0402]  9.52 22.09 180 top
L2  12nH  [L0402]  9.53 23.37 180 top
L3  18nH  [L0402]  7.11 20.83 180 top
L4  12nH  [L0402]  5.21 21.46 270 top
L5  12nH  [L0402]  3.94 21.46 90 top
L6  18nH  [L0402]  7.75 25.27 270 top
NOREF  -  [Pad_e3082]  3 41 0 top
NOREF#2  -  [Pad_e219]  43 3 0 top
NOREF#3  -  [Pad_e227]  3 3 0 top
Q1  SS8050-G(RANGE:120-200)  [SOT-23-3_L2.9-W1.3-P1.90-LS2.4-BR]  40.89 16.38 180 top
Q2  SS8050-G(RANGE:120-200)  [SOT-23-3_L2.9-W1.3-P1.90-LS2.4-BR]  37.34 16.38 0 top
R1  56kΩ  [R0402]  12.06 19.3 180 top
R6  10kΩ  [R0402]  6.48 13.59 270 top
R17  120kΩ  [R0603]  9.78 5.72 0 top
R18  10kΩ  [R0603]  39.12 18.8 0 top
R19  10kΩ  [R0603]  39.12 13.97 180 top
R20  22.1kΩ  [R0603]  38.61 5.97 0 top
R21  47.5kΩ  [R0603]  38.61 4.44 180 top
R22  2kΩ  [R0603]  35.56 4.57 0 top
R23  4.7kΩ  [R0402]  9.4 13.59 270 top
R24  4.7kΩ  [R0402]  9.4 15.88 90 top
R25  10kΩ  [R0402]  23.62 39.24 0 top
SW1  MINI MSK12CO2  [SW-SMD_MSK12CO2]  3.3 33.02 270 top
U10  CC1101RGPR  [QFN-20_L4.0-W4.0-P0.5-TL-EP]  13.17 22.47 180 top
U11  26MHz  [CRYSTAL-SMD_4P-L3.2-W2.5-BL]  12.76 29.41 180 top
U14  LSM303AGRTR  [LGA-12_L2.0-W2.0-P0.50-BL]  4.66 13.42 90 top
U19  K7803-500R3  [PWRM-TH_K7803-500R3]  26.54 6.35 270 top
U21  MAX3280EAUK+T  [SOT-23-5_L3.0-W1.7-P0.95-LS2.8-BL]  9.78 8.51 180 top
U28  CP2102N-A02-GQFN28R  [QFN-28_L5.0-W5.0-P0.50-TL-EP3.3]  36.96 10.03 0 top
U29  ESP32-WROOM-32-N4  [WIFIM-SMD_ESP32-WROOM-32-N4]  34.67 32.89 0 top
USB1  MicroXNJ  [MICRO-USB-SMD_MICROXNJ_1]  43.05 10.16 90 top

## Footprints (pads in the part's own frame, mm; a bottom-side part is the same pattern mirrored in y, then rotated)
C0402
  rect 0.79x0.54 smd: 1(-0.545,0) 2(0.545,0)
C0603
  rect 0.8x0.9 smd: 1(-0.7,0) 2(0.7,0)
C1210
  rect 1.635x2.7 smd: 1(-1.518,0) 2(1.518,0)
CAP-SMD_BD8.0-L8.3-W8.3-FD
  rect 4.2x1.4 smd: 1(-3.267,0) 2(3.267,0)
CONN-TH_WJ15EDGRC-3.81-4P
  rect 2.2x2.2 hole 1.26: 1(-5.715,0)
  round 2.2 hole 1.26: 2(-1.905,0) 3(1.905,0) 4(5.715,0)
CRYSTAL-SMD_4P-L3.2-W2.5-BL
  rect 1.4x1.2 smd: 1(-1.1,-0.85) 2(1.1,-0.85) 3(1.1,0.85) 4(-1.1,0.85)
HDR-TH_4P-P2.54-V-M
  rect 1.7x1.7 hole 1.1: 1(-3.81,0)
  round 1.7 hole 1.1: 2(-1.27,0) 3(1.27,0) 4(3.81,0)
L0402
  rect 0.79x0.54 smd: 1(-0.545,0) 2(0.545,0)
LGA-12_L2.0-W2.0-P0.50-BL
  rect 0.28x0.5 smd: 1(-0.75,-0.875) 2(-0.25,-0.875) 3(0.25,-0.875) 4(0.75,-0.875) 7(0.75,0.875) 8(0.25,0.875) 9(-0.25,0.875) 10(-0.75,0.875)
  rect 0.5x0.28 smd: 5(0.875,-0.25) 6(0.875,0.25) 11(-0.875,0.25) 12(-0.875,-0.25)
MICRO-USB-SMD_MICROXNJ_1
  rect 0.4x1.6 smd: 1(-1.3,1.6) 2(-0.65,1.6) 3(0,1.6) 4(0.65,1.6) 5(1.3,1.6)
  round 1.3 hole 0.7: 6(2.425,1.08) 9(-2.425,1.08)
  oval 1.3x1.8 hole 0.7x1.1: 7(3.625,-1.6) 8(-3.625,-1.6)
Pad_e219
  round 4 hole 2: 1(0,0)
Pad_e227
  round 4 hole 2: 1(0,0)
Pad_e3082
  round 4 hole 2: 1(0,0)
PWRM-TH_K7803-500R3
  round 2.032 hole 1.27: 1(-2.54,0) 2(0,0) 3(2.54,0)
QFN-20_L4.0-W4.0-P0.5-TL-EP
  oval 0.8x0.28 smd: 1(-2,1) 2(-2,0.5) 3(-2,0) 4(-2,-0.5) 5(-2,-1) 11(2,-1) 12(2,-0.5) 13(2,0) 14(2,0.5) 15(2,1)
  oval 0.28x0.8 smd: 6(-1,-2) 7(-0.5,-2) 8(0,-2) 9(0.5,-2) 10(1,-2) 16(1,2) 17(0.5,2) 18(0,2) 19(-0.5,2) 20(-1,2)
  rect 2.4x2.4 smd: 21(0,0)
QFN-28_L5.0-W5.0-P0.50-TL-EP3.3
  rect 0.905x0.28 smd: 1(-2.377,1.5) 2(-2.377,1) 3(-2.377,0.5) 4(-2.377,0) 5(-2.377,-0.5) 6(-2.377,-1) 7(-2.377,-1.5) 15(2.377,-1.5) 16(2.377,-1) 17(2.377,-0.5) 18(2.377,0) 19(2.377,0.5) 20(2.377,1) 21(2.377,1.5)
  rect 0.28x0.905 smd: 8(-1.5,-2.377) 9(-1,-2.377) 10(-0.5,-2.377) 11(0,-2.377) 12(0.5,-2.377) 13(1,-2.377) 14(1.5,-2.377) 22(1.5,2.377) 23(1,2.377) 24(0.5,2.377) 25(0,2.377) 26(-0.5,2.377) 27(-1,2.377) 28(-1.5,2.377)
  rect 3.35x3.35 smd: 29(0,0)
R0402
  rect 0.566x0.54 smd: 1(-0.433,0) 2(0.433,0)
R0603
  rect 0.806x0.864 smd: 1(-0.753,0) 2(0.753,0)
RF-SMD_FRF05002-JSS103M
  rect 1x1.05 smd: 1(0,-0.762)
  rect 1.05x2.2 smd: 2(-1.475,0.762) 3(1.475,0.762)
SMA_L4.4-W2.6-LS5.0-BI
  rect 2x1.8 smd: 1(-2,0) 2(2,0)
SOD-323_L1.8-W1.3-LS2.5-RD
  rect 1x0.75 smd: 1(-1.173,0) 2(1.173,0)
SOD-523_L1.2-W0.8-LS1.6-BI
  rect 0.6x0.4 smd: 1(-0.75,0) 2(0.75,0)
SOT-23-3_L2.9-W1.3-P1.90-LS2.4-BR
  rect 1.25x0.7 smd: 1(1,-0.95) 2(1,0.95) 3(-1,0)
SOT-23-5_L3.0-W1.7-P0.95-LS2.8-BL
  rect 0.49x1.157 smd: 1(-0.95,-1.153) 2(0,-1.153) 3(0.95,-1.153)
  rect 0.49x1.175 smd: 4(0.95,1.153) 5(-0.95,1.153)
SW-SMD_MSK12CO2
  rect 0.7x1.5 smd: 1(-1,1.45) 2(0,1.45) 3(1,1.45)
  rect 1x0.8 smd: 4(-2.75,0.75) 4(-2.75,-1.45) 5(2.75,0.75) 5(2.75,-1.45)
WIFIM-SMD_ESP32-WROOM-32-N4
  rect 2x0.9 smd: 1(-9,9.005) 2(-9,7.735) 3(-9,6.465) 4(-9,5.195) 5(-9,3.925) 6(-9,2.655) 7(-9,1.385) 8(-9,0.115) 9(-9,-1.155) 10(-9,-2.425) 11(-9,-3.695) 12(-9,-4.965) 13(-9,-6.235) 14(-9,-7.505) 25(9,-7.505) 26(9,-6.235) 27(9,-4.965) 28(9,-3.695) 29(9,-2.425) 30(9,-1.155) 31(9,0.115) 32(9,1.385) 33(9,2.655) 34(9,3.925) 35(9,5.195) 36(9,6.465) 37(9,7.735) 38(9,9.005)
  rect 0.9x2 smd: 15(-5.715,-9.005) 16(-4.445,-9.005) 17(-3.175,-9.005) 18(-1.905,-9.005) 19(-0.635,-9.005) 20(0.635,-9.005) 21(1.905,-9.005) 22(3.175,-9.005) 23(4.445,-9.005) 24(5.715,-9.005)
  rect 4.1x4.1 smd: 39(-0.68,1.665)

## Nets
As in the schematic, except:
GND: C1.2 C4.2 C6.2 C7.2 C8.2 C10.2 C11.1 C12.2 C13.2 C14.1 C15.2 C18.1 C19.1 C20.1 C23.2 C25.1 C27.1 C28.1 C29.1 CN1.3 D5.2 D6.1 D7.1 D8.1 H1.1 JP1.2 JP1.3 NOREF.1 NOREF#2.1 NOREF#3.1 R1.2 R21.1 SW1.4 SW1.5 U10.16 U10.19 U10.21 U11.2 U11.4 U14.6 U14.8 U19.2 U21.2 U28.3 U28.29 U29.1 U29.15 U29.38 U29.39 USB1.5 USB1.6 USB1.7 USB1.8 USB1.9

Pads without a net: U10 3; U14 7 11 12; U28 1 2 10 11 12 13 14 15 16 17 18 19 20 21 22 23 27; U29 4 5 6 8 9 10 11 12 13 14 16 17 18 19 20 21 22 23 24 26 32; USB1 4

## Via types
v1: diameter 0.61, hole 0.305, Top Layer to Bottom Layer, 76 vias

## Routing (per net, layer and track width the routed paths; a pad name or vN(x,y) marks a point on that pad's centre or on a via; arc(x,y) is an arc through that point)
+3.3V: length 142.9
  Top Layer w0.254: U28.6 34.43,9.03 33.93,8.53 ; C13.1 C14.2 3.35,12.23 U14.10 ; C13.1 1.52,12.95 v1(1.78,13.21) ; C13.1 2.67,13.37 C12.1 3.18,13.17 U14.9 ; U10.11 10.25,24.39 C20.2 ; v1(12.7,25.78) 12.7,24.5 U10.9 ; U10.14 11.18,21.96 v1(11.18,20.83) ; v1(13.46,19.43) 13.17,19.72 U10.18 ; C23.1 10.73,10.64 U21.1 ; 33.93,8.53 U28.7 ; 33.93,8.53 33.08,7.68 C28.2 33.15,6.16 C27.2 34.74,4.51 R22.1 ; R24.1 9.4,14.99 9.14,14.73 ; 9.14,14.73 v1(7.37,14.73) 6.66,14.02 R6.1 ; 9.14,14.73 9.4,14.48 R23.1 ; 23.19,39.24 23.19,40.14 23.69,40.64 ; U10.4 16.45,22.97 C18.2
  Top Layer w0.5: v1(16.47,22.2) C18.2 ; C20.2 10.96,24.6 v1(11.3,24.26) ; C27.2 33.09,4.57 v1(31.62,4.57) ; C23.1 11.27,10.47 12.6,9.14 C11.2 v1(13.46,10.67) ; v1(23.75,41.66) 23.75,40.7 23.69,40.64 25.66,40.64 U29.2
  Bottom Layer w0.254: v1(1.78,13.21) 4.19,10.8 5.72,10.8 7.37,12.45 v1(7.37,14.73) 9.4,14.73 v1(13.46,10.67) ; H1.4 17.65,40.77 21.34,37.08
  Bottom Layer w0.5: v1(31.62,4.57) 30.86,3.81 U19.3 25.27,5.08 19.05,5.08 v1(13.46,10.67) ; v1(13.46,19.43) 13.46,19.43 v1(13.46,10.67) ; v1(13.46,19.43) 15.37,19.43 16.47,20.54 v1(16.47,22.19) ; v1(13.46,19.43) 12.57,19.43 v1(11.18,20.83) 11.18,24.13 v1(11.3,24.26) 12.7,25.65 v1(12.7,25.78) ; v1(13.46,10.67) 21.34,18.54 21.34,37.08 23.75,39.5 v1(23.75,41.66)
GND: length 21.6
  Top Layer w0.254: 13.67,21.97 14.86,20.78 v1(14.86,20.7) ; 13.67,21.97 U10.21 12.17,21.47 U10.16 11.63,19.93 R1.2 ; 13.67,21.97 U10.19 ; v1(33.4,11.43) 33.4,11.22 34.1,10.53 34.58,10.53 U28.3 36.46,10.53 U28.29 ; C12.2 3.25,14.18 3.25,13.91 3.5,13.67 U14.8 4.14,13.67 4.41,13.93 4.41,14.29 U14.6 4.41,14.33 3.84,14.89 3.84,16.29 4.1,16.55 C15.2
  Top Layer w1.9: CN1.3 16.67,3.21 D5.2
  vias: v1(4.44,6.73) v1(6.1,38.86) v1(7.75,15.72) v1(8,31.75) v1(8.25,13.88) v1(11.56,15.49) v1(11.68,17.78) v1(13.46,36.83) v1(15.21,17.78) v1(16.38,14.99) v1(18.16,17.27) v1(19.3,23.11) v1(22.86,23.94) v1(27.81,29.59) v1(29.21,27.31) v1(31.02,18.8) v1(34.42,22.35) v1(34.78,7.46) v1(35.56,5.84) v1(36.07,14.73) v1(36.19,11.18) v1(37.59,30.48) v1(37.72,35.81) v1(40,39.24) v1(40.13,32.13) v1(41.91,19.43)
VBAT: length 5.7
  Top Layer w0.5: 20.89,6.7 D3.2
  Top Layer w1.9: CN1.4 20.45,6.25 D5.1
VBUS: length 19.8
  Top Layer w0.254: v1(30.61,13.46) 31.23,13.46 D8.2
  Top Layer w0.5: R20.2 40.26,6.87 v1(40.26,6.98) 40.77,7.49 40.77,8.51 41.12,8.86 41.46,8.86 ; D4.2 v1(30.61,13.46)
  Bottom Layer w0.5: v1(30.61,13.46) 30.61,10.29 32.64,8.25 38.99,8.25 v1(40.26,6.98)
VIN: length 13.7
  Top Layer w0.5: U19.1 26.39,9.05 D3.1 23.24,13.17 C10.1 24.57,15.08 C25.2 25.79,15.08 D4.1
CS: length 1.4
  Top Layer w0.254: R6.2 6.47,13.17 U14.2 U14.3
DCOUPL: length 1.4
  Top Layer w0.254: C8.1 16.08,24.38 U10.5
EN: length 40.3
  Top Layer w0.254: v1(40.44,36.71) 37.78,39.37 25.68,39.37 U29.3 25.56,39.24 R25.2 ; v1(42.93,16.76) 42.54,16.38 Q1.3
  Bottom Layer w0.254: v1(42.93,16.76) 43.69,17.53 43.69,33.4 40.44,36.65 v1(40.44,36.71)
ESP_IO0: length 14.6
  Top Layer w0.254: Q2.3 36.34,19.45 37.85,20.95 42.16,20.95 43.67,22.46 U29.25
ESP_NMEA_IN: length 48.6
  Top Layer w0.254: SW1.2 14.86,33.02 16.89,30.99 v1(16.89,27.56) ; v1(22.8,21.41) 22.78,21.41 22.63,21.57 22.63,21.58 22.28,21.92 22.28,22.17 v1(20.29,24.16) ; v1(41.78,27.94) 43.66,27.94 U29.27
  Bottom Layer w0.254: v1(22.8,21.41) 35.26,21.41 v1(41.78,27.94) ; v1(16.89,27.56) v1(20.29,24.16)
ESP_RXD0: length 32.2
  Top Layer w0.254: U28.26 36.46,13.72 v1(37.08,14.35) ; v1(43.37,16.01) 43.7,16.01 45.22,17.53 45.22,36.32 44.72,36.82 U29.34
  Bottom Layer w0.254: v1(43.37,16.01) 41.72,14.35 v1(37.08,14.35)
ESP_TXD0: length 33.9
  Top Layer w0.254: U28.25 36.96,13.33 v1(37.21,13.59) ; U29.35 44.25,38.09 45.57,36.76 45.57,17.38 41.91,13.72 41.28,13.72 40.13,12.57 39.5,12.57
  Bottom Layer w0.254: v1(39.53,12.61) 38.55,13.59 v1(37.21,13.59)
GDO0: length 15.6
  Top Layer w0.254: U10.6 15.2,24.47 25.01,34.28 U29.7
GNSS_IN: length 11
  Top Layer w0.254: SW1.1 7.35,34.02 11.43,38.1 H1.2
GNSS_OUT: length 35.6
  Top Layer w0.254: U29.28 43.13,29.74 36.98,29.74 v1(36.07,28.82) ; v1(23.5,34.92) 19.81,34.92 H1.3 ; v1(30.73,30.01) 30.73,30.04 v1(29.59,31.18)
  Bottom Layer w0.254: v1(30.73,30.01) 32.09,28.66 34.17,28.66 34.56,29.05 35.84,29.05 v1(36.07,28.82) ; v1(29.59,31.18) 25.84,34.92 v1(23.5,34.92)
I2C_SCL: length 52.9
  Top Layer w0.254: U29.36 43.66,39.37 43.11,39.37 42.39,38.65 42.39,36.89 34.04,28.53 v1(34.04,27.56) ; v1(26.17,22) 25.72,22 22.68,18.95 18.71,18.95 12.92,13.16 R23.2 8.84,12.59 5.6,12.59 U14.1
  Bottom Layer w0.254: v1(34.04,27.56) 34.04,24.38 31.42,21.77 26.4,21.77 v1(26.17,22)
I2C_SDA: length 49.6
  Top Layer w0.254: U29.33 41.56,35.55 34.64,28.63 v1(34.64,28.3) ; U14.4 5.53,14.55 7.29,16.31 R24.2 14.12,16.31 v1(14.17,16.26) ; v1(22.11,21.03) 22.11,20.59 21.9,20.37 18.19,20.37 v1(17.96,20.6)
  Bottom Layer w0.254: v1(17.96,20.6) 17.96,18.98 15.24,16.26 v1(14.17,16.26) ; v1(22.11,21.03) 22.11,22.37 28.05,28.3 v1(34.64,28.3)
LSM_C1: length 1.2
  Top Layer w0.254: C15.1 4.95,14.34 U14.5
NMEA0183_IN: length 35.5
  Top Layer w0.254: U21.3 7.93,8.76 1.4,8.76 0.43,9.73 0.43,31.16 1.51,32.25 4.52,32.25 SW1.3
NMEA0183_IN+: length 4.3
  Top Layer w0.254: U21.4 8.83,5.91 R17.1 9.02,5.71 CN1.1
NMEA0183_IN-: length 5.2
  Top Layer w0.254: U21.5 10.73,5.91 R17.2 12.83,3.42 CN1.2
RBIAS: length 1.2
  Top Layer w0.254: U10.17 12.67,19.48 R1.1
RF_N: length 1.3
  Top Layer w0.254: U10.13 10.45,22.47 L1.1
RF_P: length 1.3
  Top Layer w0.254: U10.12 10.47,22.97 L2.1
SPI_CLK: length 34.5
  Top Layer w0.254: U10.1 16.98,19.66 22.38,19.66 28.24,25.52 30.02,25.52 33.58,29.08 v1(33.58,29.41) ; v1(42.29,31.75) 43.66,31.75 U29.30
  Bottom Layer w0.254: v1(42.29,31.75) 39.95,29.41 v1(33.58,29.41)
SPI_CS: length 33.9
  Top Layer w0.254: v1(18.29,28.45) 18.29,28.06 15.41,25.19 14.04,25.19 13.67,24.82 U10.7 ; v1(20.63,28.45) v1(22.1,28.45) ; U29.29 43.3,30.09 39.36,30.09 v1(38.15,31.31)
  Bottom Layer w0.254: v1(38.15,31.31) 30.8,31.31 30.1,30.61 29.84,30.61 29.83,30.59 29.35,30.59 29.34,30.61 24.26,30.61 v1(22.1,28.45) ; v1(18.29,28.45) v1(20.63,28.45)
SPI_MISO: length 35.9
  Top Layer w0.254: U29.31 43.66,33.02 v1(42.29,33.02) ; v1(34.16,29.99) 33.34,29.99 33,29.65 33,29 29.88,25.88 28.1,25.88 22.23,20.02 17.13,20.02 16.09,21.05 16.09,21.4 15.52,21.97 U10.2
  Bottom Layer w0.254: v1(34.16,29.99) 34.38,29.76 39.8,29.76 41.71,31.67 41.71,32.44 v1(42.29,33.02)
SPI_MOSI: length 40.3
  Top Layer w0.254: U10.20 15.34,19.3 22.53,19.3 28.39,25.17 30.17,25.17 42.04,37.03 42.04,39.57 43.1,40.63 U29.37
USB_D+: length 16.6
  Top Layer w0.254: v1(33.4,10.28) 33.65,10.03 U28.4 ; 41.46,10.16 42.8,10.16 43.05,10.41 ; v1(34.16,12.95) 34.16,13.54 D6.2
  Bottom Layer w0.254: v1(34.16,12.95) 34.16,11.04 v1(33.4,10.28) 33.67,10.01 42.65,10.01 43.05,10.41
  vias: v1(43.05,10.28)
USB_D-: length 17.4
  Top Layer w0.254: 41.46,9.51 42.94,9.51 v1(43.05,9.4) ; v1(32.76,12.95) 32.77,12.96 D7.2 ; v1(33.4,9.27) 33.66,9.53 U28.5
  Bottom Layer w0.254: v1(43.05,9.4) 42.8,9.66 33.78,9.66 v1(33.4,9.27) 32.76,9.91 v1(32.76,12.95)
XTAL_Q1: length 6.6
  Top Layer w0.254: U11.1 13.39,29.79 13.39,29.79 12.88,29.27 12.88,27.84 13.39,27.33 C1.1 13.17,26.75 13.17,26.14 13.28,26.02 13.28,25.54 13.17,25.43 U10.8
XTAL_Q2: length 6.7
  Top Layer w0.254: U10.10 12.17,25.48 12.12,25.54 12.12,26.02 12.17,26.08 12.17,26.73 C19.2 12.52,27.55 12.52,29.34 12.48,29.38 12.06,29.38 11.66,28.97 U11.3
$1N23077: length 4.8
  Top Layer w0.254: Q1.2 39.89,13.99 R19.1 39.04,13.14 37.7,13.14 37.46,12.9 U28.24
$1N23080: length 1.5
  Top Layer w0.254: Q1.1 39.89,18.77 R18.2
$1N23084: length 8.2
  Top Layer w0.254: U28.28 35.46,15.11 36.09,15.75 37.08,15.75 38.34,17 Q2.2 38.36,17.36 R18.1
$1N23089: length 1.5
  Top Layer w0.254: Q2.1 38.36,15.41 R19.2
$1N23504: length 5.1
  Top Layer w0.254: U28.8 35.46,6.78 36.15,6.1 37.73,6.1 R20.1 R21.2
$1N23624: length 3.2
  Top Layer w0.254: U28.9 35.96,7.11 v1(36.32,6.75) ; R22.2 36.32,4.58 v1(36.32,5.46)
  Bottom Layer w0.254: v1(36.32,5.46) v1(36.32,6.75)
$3N1118: length 3.9
  Top Layer w0.254: C3.2 8.88,22.19 L1.2 8.98,20.83 C4.1 8.8,20.83 L3.1
$3N1119: length 2.7
  Top Layer w0.254: L4.1 6.3,22.01 C5.1 6.57,22.1 L3.2
$3N1120: length 2.6
  Top Layer w0.254: C7.1 5.21,19.59 L4.2 L5.1
$3N1121: length 1.1
  Top Layer w0.254: JP1.1 L5.2
$3N1122: length 1.4
  Top Layer w0.254: C6.1 7.78,25.86 L6.1
$3N1126: length 4
  Top Layer w0.254: C3.1 8.89,23.28 L2.2 ; C3.1 C5.2 ; C3.1 L6.2

## Copper pours and planes (outline as drawn; the poured copper is in the pictures)
GND on Top Layer: 31.37,37.21 36.45,37.21 36.45,32.26 31.37,32.26
GND on Top Layer: -0.51,44.45 46.35,44.45 46.35,-0.38 -0.51,-0.38
GND on Bottom Layer: -0.89,44.96 46.74,44.96 46.74,-0.76 -0.89,-0.76

## Text on the board
Bottom Silkscreen Layer: IN+ | IN- | +12V | GND | NMEA / 0183 | BAT / PWR | http://www.github.com/Rodemfr/MicronetToNMEA | MicronetToNMEA | HW v3.0
Top Silkscreen Layer: GND | RX | TX | 3.3V | COMPASS | X | Z | Y | GNSS | AIS
